# Altium project HVPS.PrjPcb
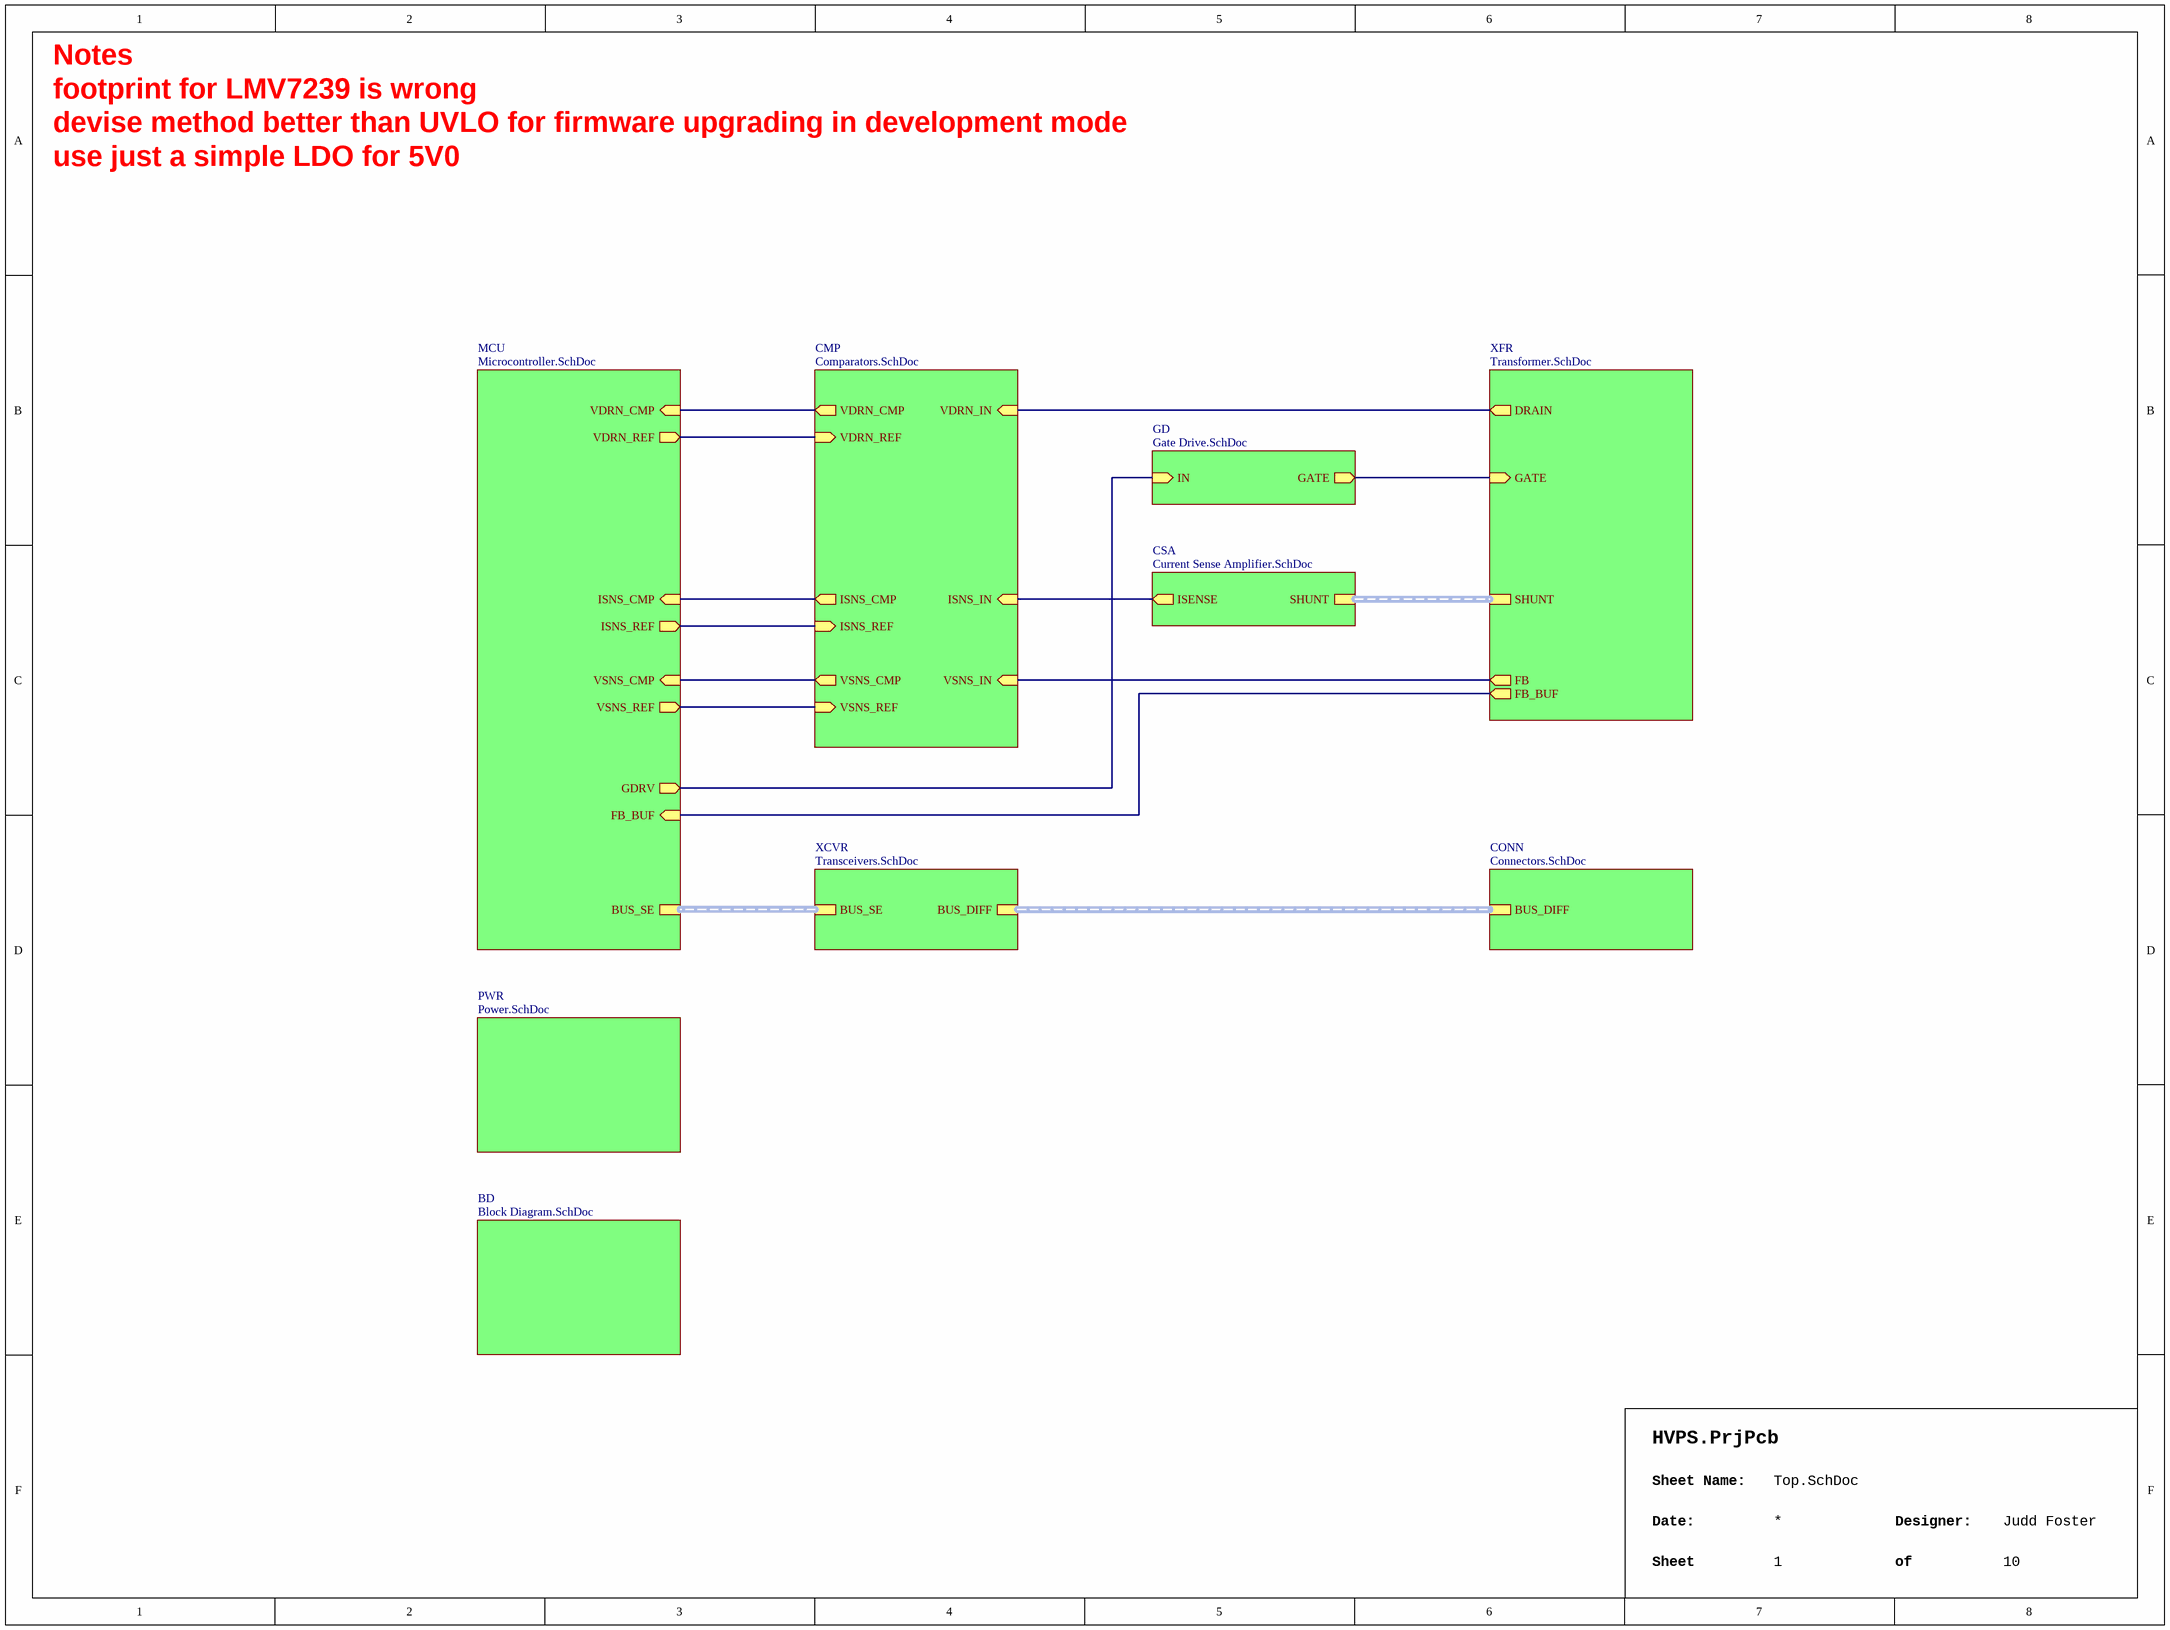
[diagram p0: Top.SchDoc]
Designer: Judd Foster
10 sheets, 140 parts. Net scope: hierarchical (ports join the sheet entries above them; power ports are global).
Board file: HVPS.PcbDoc
Sheets:
  Top.SchDoc
    BD = Block Diagram.SchDoc
    XFR = Transformer.SchDoc
    CSA = Current Sense Amplifier.SchDoc
    PWR = Power.SchDoc
    GD = Gate Drive.SchDoc
    CONN = Connectors.SchDoc
    XCVR = Transceivers.SchDoc
    CMP = Comparators.SchDoc
    MCU = Microcontroller.SchDoc

## Sheet Top.SchDoc
size 406 x 304 mm; SheetNumber: 1; SheetTotal: 10

### Sub-sheets
BD = Block Diagram.SchDoc: no entries
CMP = Comparators.SchDoc: ISNS_CMP (out), VSNS_CMP (out), VDRN_CMP (out), ISNS_REF (in), ISNS_IN (in), VSNS_REF (in), VSNS_IN (in), VDRN_REF (in), VDRN_IN (in)
CONN = Connectors.SchDoc: BUS_DIFF (harness BUS_DIFF)
CSA = Current Sense Amplifier.SchDoc: SHUNT (harness SHUNT), ISENSE (out)
GD = Gate Drive.SchDoc: GATE (out), IN (in)
MCU = Microcontroller.SchDoc: VDRN_CMP (in), VDRN_REF (out), ISNS_CMP (in), ISNS_REF (out), VSNS_CMP (in), VSNS_REF (out), BUS_SE (harness BUS_SE), GDRV (out), FB_BUF (in)
PWR = Power.SchDoc: no entries
XCVR = Transceivers.SchDoc: BUS_SE (harness BUS_SE), BUS_DIFF (harness BUS_DIFF)
XFR = Transformer.SchDoc: DRAIN (out), GATE (in), FB (out), SHUNT (harness SHUNT), FB_BUF (out)

### Nets
DRAIN: sheet XFR/DRAIN, sheet CMP/VDRN_IN
GATE: sheet XFR/GATE, sheet GD/GATE
GDRV: sheet GD/IN, sheet MCU/GDRV
ISENSE: sheet CSA/ISENSE, sheet CMP/ISNS_IN
ISNS_CMP: sheet CMP/ISNS_CMP, sheet MCU/ISNS_CMP
ISNS_REF: sheet CMP/ISNS_REF, sheet MCU/ISNS_REF
VDIV: sheet XFR/FB, sheet CMP/VSNS_IN
VDIV_BUF: sheet XFR/FB_BUF, sheet MCU/FB_BUF
VDRN_CMP: sheet CMP/VDRN_CMP, sheet MCU/VDRN_CMP
VDRN_REF: sheet CMP/VDRN_REF, sheet MCU/VDRN_REF
VSNS_CMP: sheet CMP/VSNS_CMP, sheet MCU/VSNS_CMP
VSNS_REF: sheet CMP/VSNS_REF, sheet MCU/VSNS_REF

### Buses and harness runs
harness sheet CONN/BUS_DIFF = sheet XCVR/BUS_DIFF
harness sheet CSA/SHUNT = sheet XFR/SHUNT
harness sheet MCU/BUS_SE = sheet XCVR/BUS_SE

### Notes on the sheet
- Notes
- footprint for LMV7239 is wrong
- devise method better than UVLO for firmware upgrading in development mode
- use just a simple LDO for 5V0
- Sheet Name:
- Date:
- Sheet
- Designer:
- of

## Sheet Block Diagram.SchDoc
size 406 x 304 mm; SheetNumber: 2; SheetTotal: 10
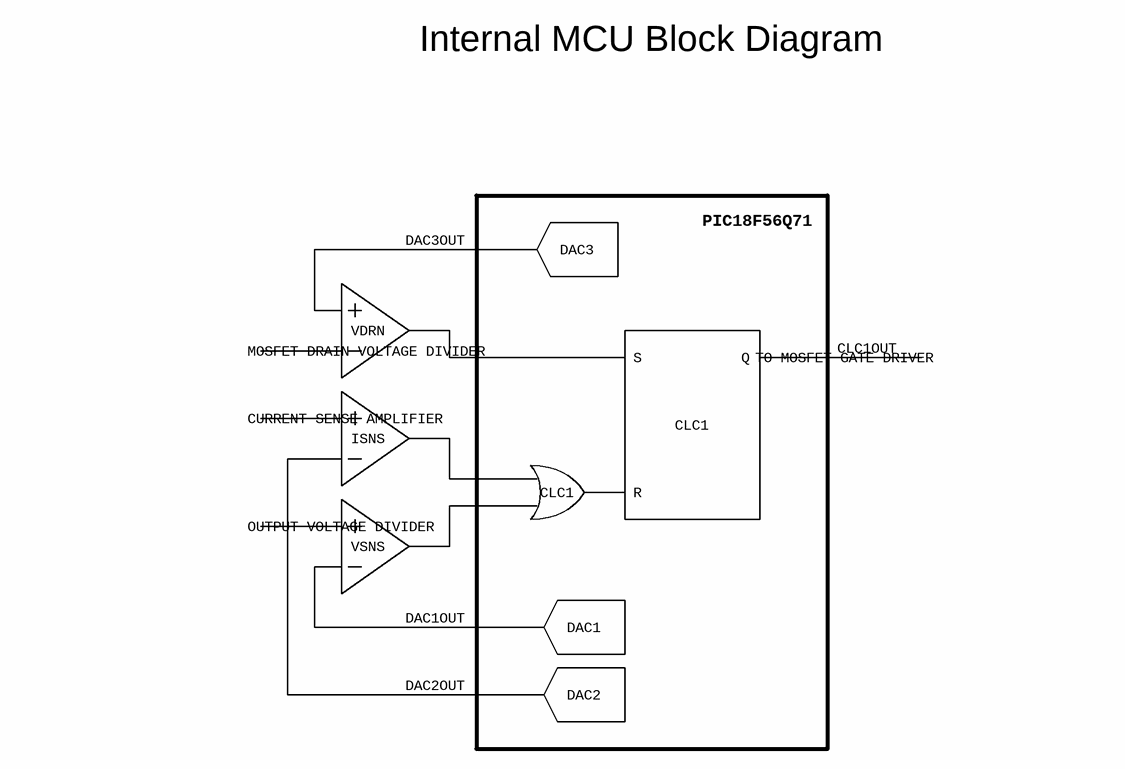
[diagram p1: Block Diagram.SchDoc]

### Notes on the sheet
- Internal MCU Block Diagram
- PIC18F56Q71
- DAC3OUT
- DAC3
- MOSFET DRAIN VOLTAGE DIVIDER
- VDRN
- S
- Q
- CLC1OUT
- TO MOSFET GATE DRIVER
- CURRENT SENSE AMPLIFIER
- CLC1
- ISNS
- R
- OUTPUT VOLTAGE DIVIDER
- VSNS
- DAC1OUT
- DAC1
- DAC2OUT
- DAC2
- Sheet Name:
- Date:
- Sheet
- Designer:
- of

## Sheet Transformer.SchDoc
size 406 x 304 mm; SheetNumber: 3; SheetTotal: 10
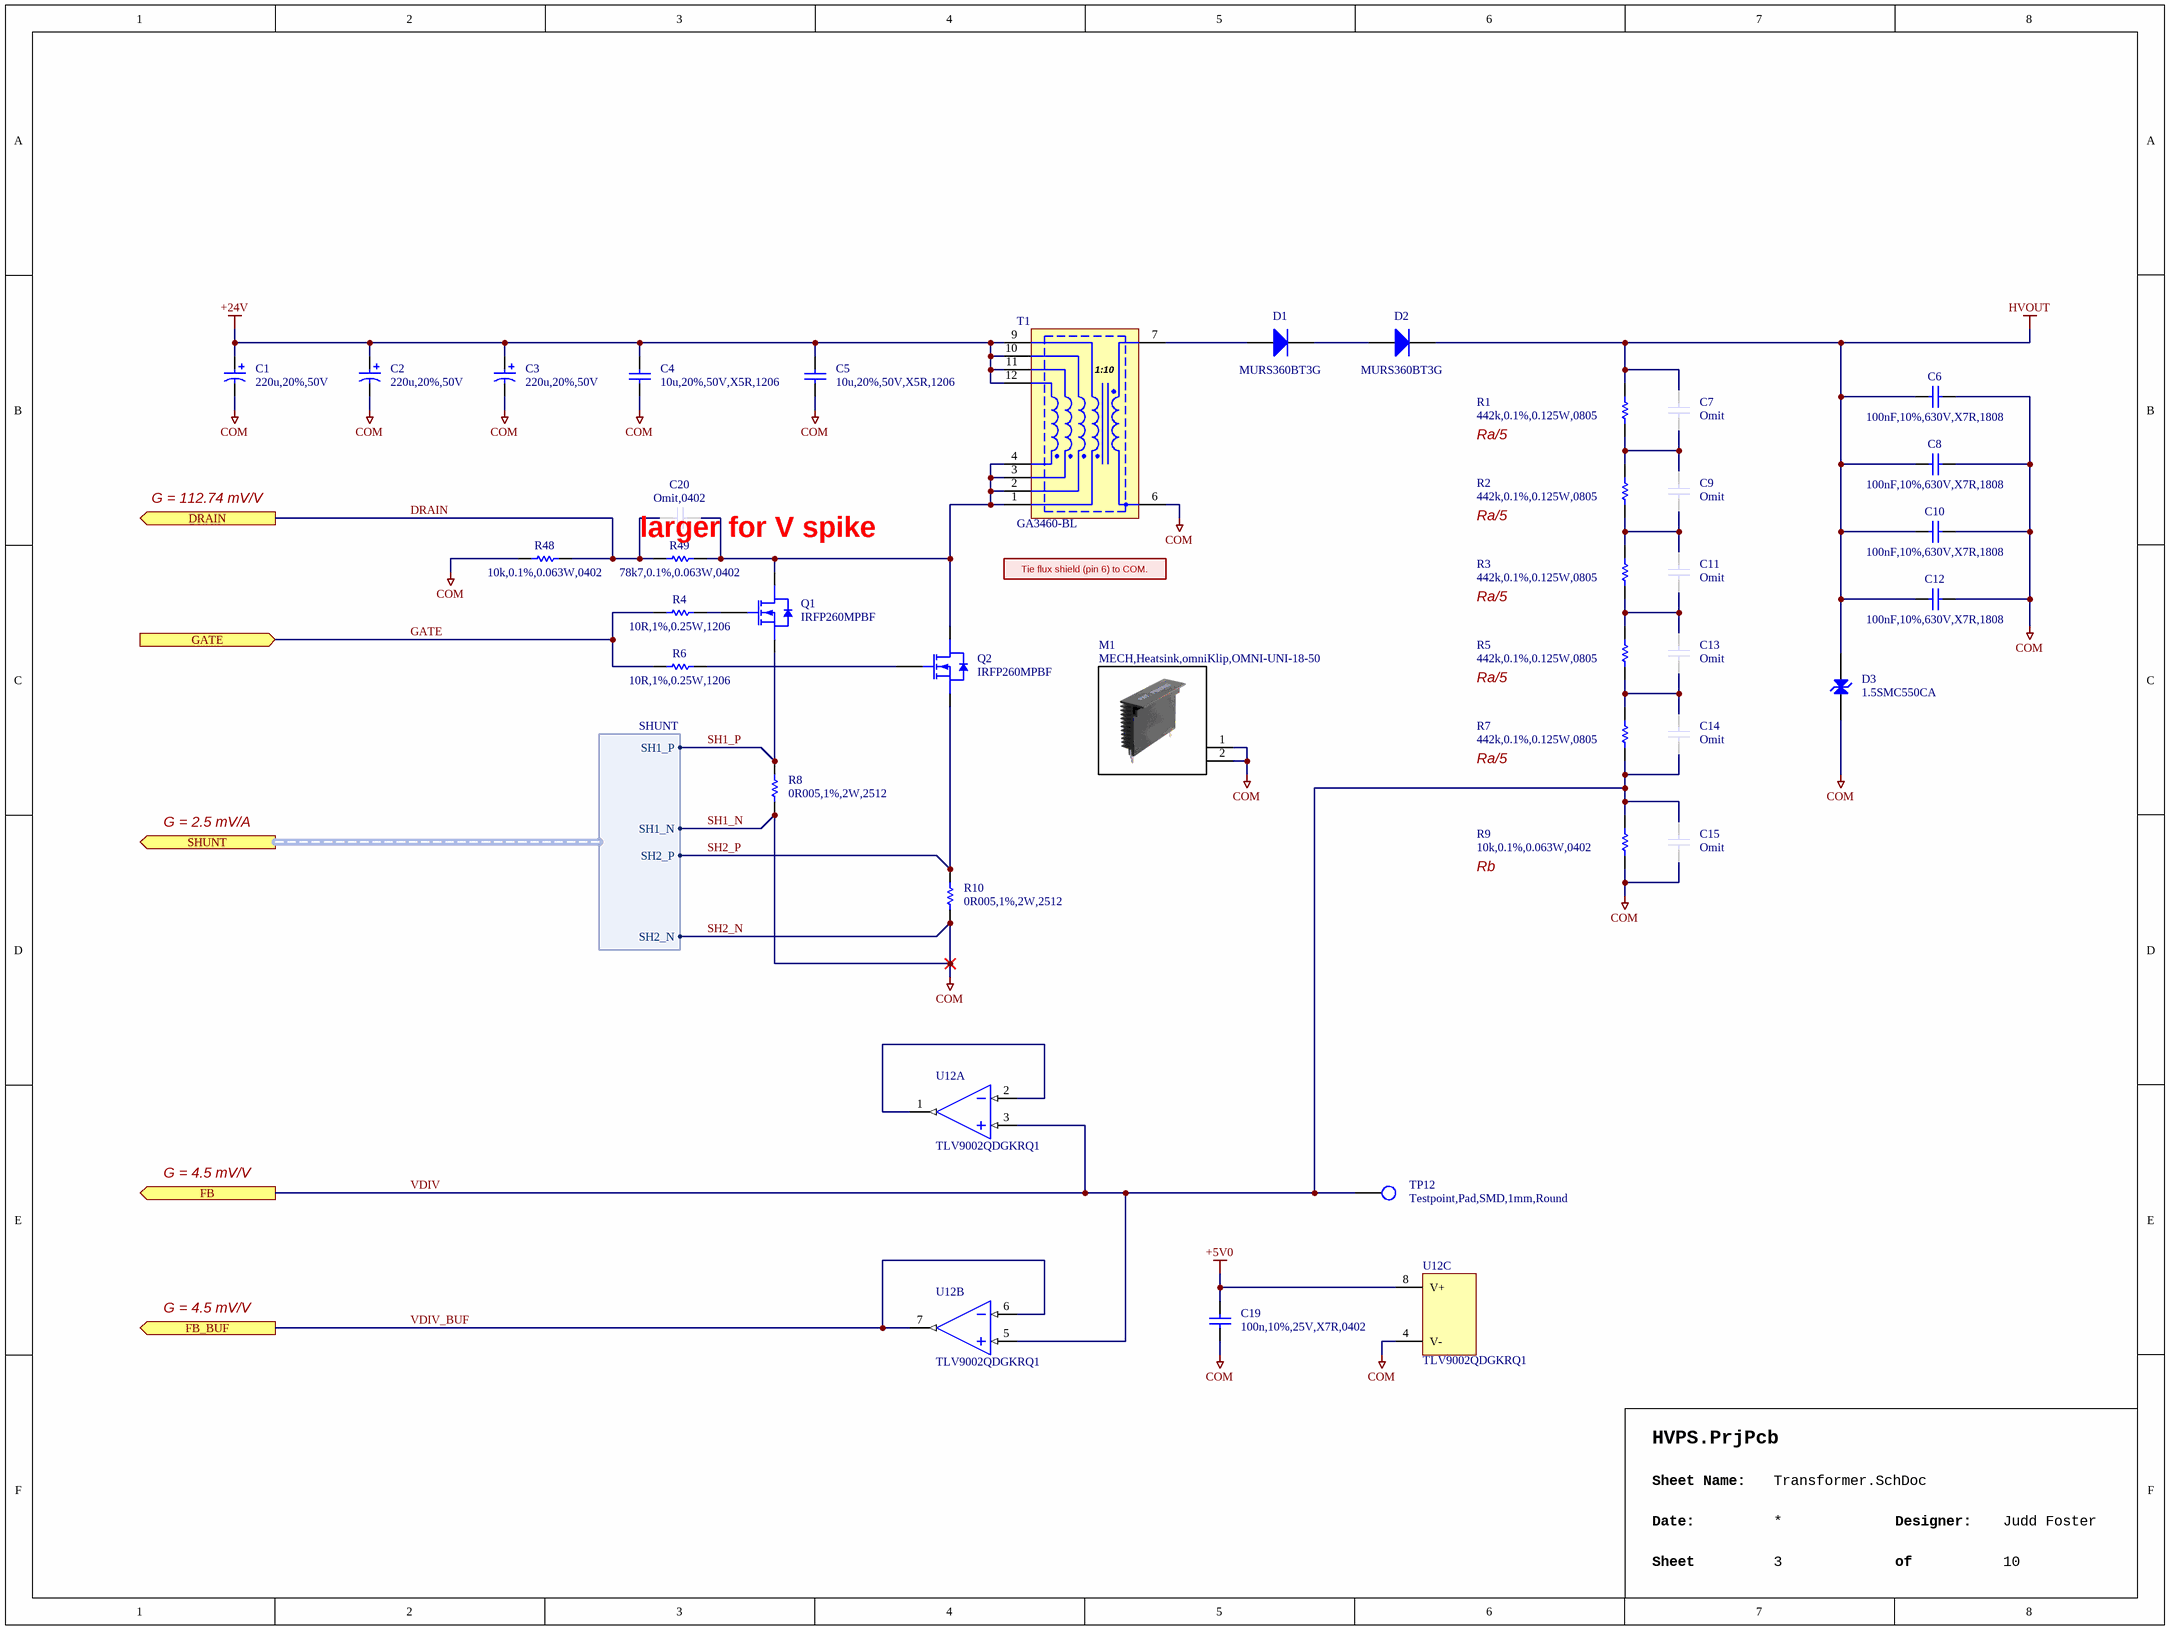
[diagram p2: Transformer.SchDoc]

### Parts
C1  220u,20%,50V  [CAPPR500W60D1000H1600B]
C2  220u,20%,50V  [CAPPR500W60D1000H1600B]
C3  220u,20%,50V  [CAPPR500W60D1000H1600B]
C4  10u,20%,50V,X5R,1206  [CAPC3216X16N]
C5  10u,20%,50V,X5R,1206  [CAPC3216X16N]
C6  100nF,10%,630V,X7R,1808  [KEMET_PKG_LC]
C7  Omit  [CAPC_0805]  (no BOM)
C8  100nF,10%,630V,X7R,1808  [KEMET_PKG_LC]
C9  Omit  [CAPC_0805]  (no BOM)
C10  100nF,10%,630V,X7R,1808  [KEMET_PKG_LC]
C11  Omit  [CAPC_0805]  (no BOM)
C12  100nF,10%,630V,X7R,1808  [KEMET_PKG_LC]
C13  Omit  [CAPC_0805]  (no BOM)
C14  Omit  [CAPC_0805]  (no BOM)
C15  Omit  [CAPC_0805]  (no BOM)
C19  100n,10%,25V,X7R,0402  [CAPC1005X06N]
C20  Omit,0402  [CAPC1005X06N]  (no BOM)
D1  MURS360BT3G  [ONSEMI_SMB]
D2  MURS360BT3G  [ONSEMI_SMB]
D3  1.5SMC550CA  [LITTELFUSE_DO-214AB]
M1  MECH,Heatsink,omniKlip,OMNI-UNI-18-50  [WAKEFIELD_OMNI-UNI-18-50]
Q1  IRFP260MPBF  [INFINEON_PKG_TO247AD]
Q2  IRFP260MPBF  [INFINEON_PKG_TO247AD]
R1  442k,0.1%,0.125W,0805  [RESC2012X07N]
R2  442k,0.1%,0.125W,0805  [RESC2012X07N]
R3  442k,0.1%,0.125W,0805  [RESC2012X07N]
R4  10R,1%,0.25W,1206  [RESC3216X06N]
R5  442k,0.1%,0.125W,0805  [RESC2012X07N]
R6  10R,1%,0.25W,1206  [RESC3216X06N]
R7  442k,0.1%,0.125W,0805  [RESC2012X07N]
R8  0R005,1%,2W,2512  [OHMITE_PKG_MCS3264]
R9  10k,0.1%,0.063W,0402  [RESC1005X04N]
R10  0R005,1%,2W,2512  [OHMITE_PKG_MCS3264]
R48  10k,0.1%,0.063W,0402  [RESC1005X04N]
R49  78k7,0.1%,0.063W,0402  [RESC1005X04N]
T1  GA3460-BL  [COILCRAFT_GA3460-BL]
TP12  Testpoint,Pad,SMD,1mm,Round  [TP100]
U12  TLV9002QDGKRQ1  [SOP65P490X110-8]  (parts A,B,C of 3)

### Ports
DRAIN (out), FB (out), FB_BUF (out), GATE (in), SHUNT (out, harness SHUNT)

### Harnesses
SHUNT: SH1_P, SH1_N, SH2_P, SH2_N

### Nets
+5V0: C19.2 U12.8(V+)
+24V: C1.1 C2.1 C3.1 C4.2 C5.2 T1.9 T1.10 T1.11 T1.12
COM: C1.2 C2.2 C3.2 C4.1 C5.1 C6.1 C8.1 C10.1 C12.1 C15.1 C19.1 D3.2(A) M1.1 M1.2 R8.1 R9.1 R10.1 R48.2 T1.6 U12.4(V-) ; port SHUNT.SH1_N, port SHUNT.SH2_N  [also labelled SH1_N, SH2_N]
HVOUT: C6.2 C7.2 C8.2 C10.2 C12.2 D2.1(K) D3.1(K) R1.2
DRAIN: C20.1 R48.1 R49.1 ; port DRAIN
GATE: R4.1 R6.1 ; port GATE
SH1_P: Q1.3(S) R8.2 ; port SHUNT.SH1_P
SH2_P: Q2.3(S) R10.2 ; port SHUNT.SH2_P
VDIV: C14.1 C15.2 R7.1 R9.2 TP12.1(TP) U12.3(IN1+) U12.5(IN2+) ; port FB
VDIV_BUF: U12.6(IN2-) U12.7(OUT2) ; port FB_BUF
NetC7_1: C7.1 C9.2 R1.1 R2.2
NetC9_1: C9.1 C11.2 R2.1 R3.2
NetC11_1: C11.1 C13.2 R3.1 R5.2
NetC13_1: C13.1 C14.2 R5.1 R7.2
NetC20_2: C20.2 Q1.2(D) Q2.2(D) R49.2 T1.1 T1.2 T1.3 T1.4
NetD1_1: D1.1(K) D2.2(A)
NetD1_2: D1.2(A) T1.7
NetQ1_1: Q1.1(G) R4.2
NetQ2_1: Q2.1(G) R6.2
NetU12_1: U12.1(OUT1) U12.2(IN1-)

### Notes on the sheet
- Ra/5
- G = 112.74 mV/V
- (near C20) larger for V spike
- Tie flux shield (pin 6) to COM.
- G = 2.5 mV/A
- Rb
- G = 4.5 mV/V
- Sheet Name:
- Date:
- Sheet
- Designer:
- of
- (in symbol XFR,Flyback,COILCRAFT_GA3460-BL) 1:10

### Library data of the parts
C1-C3 = CAP,Alum,220uF,20%,50VDC,Radial,Thru: 220 ï¿½F 50 V Aluminum Electrolytic Capacitors Radial, Can 5000 Hrs @ 105ï¿½C; Manufacturer 1: Rubycon; Manufacturer 1 Part Number: 50YXG220MEFCT810X16; Vendor 1 Part Number: 1189-3771-1-ND; Vendor 1: Digikey; Part Name: CAP,Alum,220uF,20%,50VDC,Radial,Thru; CreatedBy: Judd Foster; HelpURL: https://www.rubycon.co.jp/wp-content/uploads/catalog-aluminum/YXG.pdf; Value: 220u
C4 C5 = CAP,Cer,10uF,50VDC,X5R,1206: 10ï¿½F ï¿½20% 50V Ceramic Capacitor X5R 1206 (3216 Metric); Manufacturer 1: Samsung Electro-Mechanics; Manufacturer 1 Part Number: CL31A106MBHNNNE; Vendor 1 Part Number: 1276-6736-1-ND; Vendor 1: Digikey; Part Name: CAP,Cer,10uF,50VDC,X5R,1206; CreatedBy: Judd Foster; HelpURL: https://www.samsungsem.com/resources/file/global/support/product_catalog/MLCC.pdf; Value: 10u
C6 C8 C10 C12 = CAP,Cer,100nF,10%,630V,X7R,1808: 0.1 ÂµF Â±10% 630V Ceramic Capacitor X7R 1808 (4520 Metric); Manufacturer 1: KEMET; Manufacturer 1 Part Number: C1808C104KBRAC7800; Vendor 1 Part Number: 399-C1808C104KBRAC7800CT-ND; Vendor 1: DigiKey; Part Name: CAP,Cer,100nF,10%,630V,X7R,1808; CreatedBy: Judd Foster; HelpURL: https://content.kemet.com/datasheets/KEM_C1010_X7R_HV_SMD.pdf; Value: 100nF
C7 C9 C11 C13-C15 = CAP,Omit,0805: Part Name: CAP,Omit,0805; CreatedBy: Judd Foster; HelpURL: N/A; Manufacturer 1: N/A; Manufacturer 1 Part Number: N/A; Vendor 1: N/A; Vendor 1 Part Number: N/A; Value: Omit
C19 = CAP,Cer,100nF,10%,25V,X7R,0402: 0.1ï¿½F ï¿½10% 25V Ceramic Capacitor X7R 0402 (1005 Metric); Manufacturer 1: Murata Electronics; Manufacturer 1 Part Number: GRM155R71E104KE14J; Vendor 1 Part Number: 490-14603-1-ND; Vendor 1: DigiKey; Value: 100nF; Part Name: CAP,Cer,100nF,10%,25V,X7R,0402; CreatedBy: Judd Foster; HelpURL: https://search.murata.co.jp/Ceramy/image/img/A01X/G101/ENG/GRM155R71E104KE14-01.pdf
C20 = CAP,Omit,0402: Omit; Part Name: CAP,Omit,0402; CreatedBy: Judd Foster; HelpURL: N/A; Manufacturer 1: N/A; Manufacturer 1 Part Number: N/A; Vendor 1: N/A; Vendor 1 Part Number: N/A; Value: Omit
D1 D2 = Diode,Gen,600V,3A,SMB: Diode 600 V 3A Surface Mount SMB; Manufacturer 1: onsemi; Vendor 1 Part Number: MURS360BT3GOSCT-ND; Vendor 1: Digikey; Part Name: Diode,Gen,600V,3A,SMB; CreatedBy: Judd Foster; HelpURL: https://www.onsemi.com/pdf/datasheet/murs360bt3-d.pdf; Manufacturer 1 Part Number: MURS360BT3G
D3 = DIODE,TVS,495VWM,SMD: 760V Clamp 2A Ipp Tvs Diode Surface Mount DO-214AB (SMCJ); Manufacturer 1: Littelfuse Inc.; Vendor 1 Part Number: 1.5SMC550CACT-ND; Vendor 1: Digikey; Part Name: DIODE,TVS,495VWM,SMD; CreatedBy: Judd Foster; HelpURL: https://www.littelfuse.com/~/media/electronics/datasheets/tvs_diodes/littelfuse_tvs_diode_1_5smc_datasheet.pdf.pdf; Manufacturer 1 Part Number: 1.5SMC550CA
M1 = MECH,Heatsink,omniKlip,OMNI-UNI-18-50: Heat Sinks omniKlip Heat Sink for TO-247, TO-264, 18mm Wide, 50mm Long, Aluminum; Manufacturer 1: Wakefield Thermal; Vendor 1 Part Number: 567-OMNI-UNI-18-50; Vendor 1: Mouser; Part Name: MECH,Heatsink,omniKlip,OMNI-UNI-18-50; CreatedBy: Judd Foster; HelpURL: https://www.mouser.com/datasheet/2/433/omniKlip_Wakefield_Vette-3050203.pdf; Manufacturer 1 Part Number: OMNI-UNI-18-50
Q1 Q2 = MOSFET,N Ch,200V,50A,IRFP260MPBF: N-Channel 200 V 50A (Tc) 300W (Tc) Through Hole TO-247AC; Manufacturer 1: Infineon Technologies; Vendor 1 Part Number: IRFP260MPBF-ND; Vendor 1: DigiKey; Part Name: MOSFET,N Ch,200V,50A,IRFP260MPBF; CreatedBy: Judd Foster; HelpURL: https://www.infineon.com/dgdl/irfp260mpbf.pdf?fileId=5546d462533600a40153562894e91fe0; Manufacturer 1 Part Number: IRFP260MPBF
R1-R3 R5 R7 = RES,442k,0.1%,0.125W,0805: 442 kOhms Â±0.1% 0.125W, 1/8W Chip Resistor 0805 (2012 Metric) Automotive AEC-Q200 Thin Film; Manufacturer 1: Panasonic Electronic Components; Manufacturer 1 Part Number: ERA-6AEB4423V; Vendor 1 Part Number: P442KDACT-ND; Vendor 1: DigiKey; Part Name: RES,442k,0.1%,0.125W,0805; CreatedBy: Judd Foster; HelpURL: https://industrial.panasonic.com/cdbs/www-data/pdf/RDM0000/AOA0000C307.pdf; Value: 442k
R4 R6 = RES,10R,1%,0.25W,1206: 10 ï¿½1% 0.25W, 1/4W Chip Resistor 1206 (3216 Metric) Automotive AEC-Q200, Moisture Resistant Thick Film; Manufacturer 1: TE Connectivity Passive Product; Manufacturer 1 Part Number: CRGCQ1206F10R; Vendor 1 Part Number: A129786CT-ND; Vendor 1: Digikey; Part Name: RES,10R,1%,0.25W,1206; CreatedBy: Judd Foster; HelpURL: https://www.te.com/commerce/DocumentDelivery/DDEController?Action=srchrtrv&DocNm=1773204-3&DocType=DS&DocLang=English; Value: 10R
R8 R10 = RES,0R005,1%,2W,2512: 5 mOhms Â±1% 2W Chip Resistor 2512 (6432 Metric) Current Sense, Flame Retardant Coating, Safety Metal Element; Manufacturer 1: Ohmite; Manufacturer 1 Part Number: MCS3264R005FER; Vendor 1 Part Number: MCS3264R005FERCT-ND; Vendor 1: DigiKey; Value: 5m; Part Name: RES,0R005,1%,2W,2512; CreatedBy: Judd Foster; HelpURL: https://www.ohmite.com/assets/images/res-mcs.pdf
R9 R48 = RES,10k,0.1%,0.063W,0402: 10 kOhms ï¿½0.1% 0.1W, 1/10W Chip Resistor 0402 (1005 Metric) Automotive AEC-Q200 Thin Film; Manufacturer 1: Stackpole Electronics Inc; Manufacturer 1 Part Number: RNCF0402BTE10K0; Vendor 1 Part Number: RNCF0402BTE10K0CT-ND; Vendor 1: Digikey; Part Name: RES,10k,0.1%,0.063W,0402; CreatedBy: Judd Foster; HelpURL: https://www.seielect.com/catalog/sei-rncf.pdf; Value: 10k
R49 = RES,78k7,0.1%,0.063W,0402: 78.7 kOhms ï¿½0.1% 0.063W, 1/16W Chip Resistor 0402 (1005 Metric) Thin Film; Manufacturer 1: Yageo; Manufacturer 1 Part Number: RT0402BRD0778K7L; Vendor 1 Part Number: YAG4311CT-ND; Vendor 1: Digikey; Part Name: RES,78k7,0.1%,0.063W,0402; CreatedBy: Judd Foster; HelpURL: https://www.yageo.com/upload/media/product/productsearch/datasheet/rchip/PYu-RT_1-to-0.01_RoHS_L_13.pdf; Value: 78k7
T1 = XFR,Flyback,COILCRAFT_GA3460-BL: Audio Transformers / Signal Transformers GA3460 for LT3751 500V 50A; Vendor 1 Part Number: 994-GA3460-BL; Vendor 1: Mouser; Part Name: XFR,Flyback,COILCRAFT_GA3460-BL; CreatedBy: Judd Foster; HelpURL: https://www.mouser.ca/datasheet/2/597/ga3459-463457.pdf; Manufacturer 1: Coilcraft; Manufacturer 1 Part Number: GA3460-BL
TP12 = Testpoint,Pad,SMD: PCB Testpoint 1mm Round; Part Name: Testpoint,Pad,SMD; CreatedBy: Judd Foster; HelpURL: N/A; Manufacturer 1: N/A; Manufacturer 1 Part Number: N/A; Vendor 1: N/A; Vendor 1 Part Number: N/A
U12 = TLV9002QDGKRQ1: General Purpose Amplifier Circuit Rail-to-Rail 8-VSSOP; Manufacturer 1: Texas Instruments; Vendor 1 Part Number: 296-TLV9002QDGKRQ1CT-ND; Vendor 1: Digikey; Part Name: TLV9002QDGKRQ1; CreatedBy: Judd Foster; HelpURL: https://www.ti.com/lit/ds/symlink/tlv9001-q1.pdf?ts=1702270446565&ref_url=https%253A%252F%252Fwww.google.com%252F; Manufacturer 1 Part Number: TLV9002QDGKRQ1

## Sheet Current Sense Amplifier.SchDoc
size 406 x 304 mm; SheetNumber: 4; SheetTotal: 10
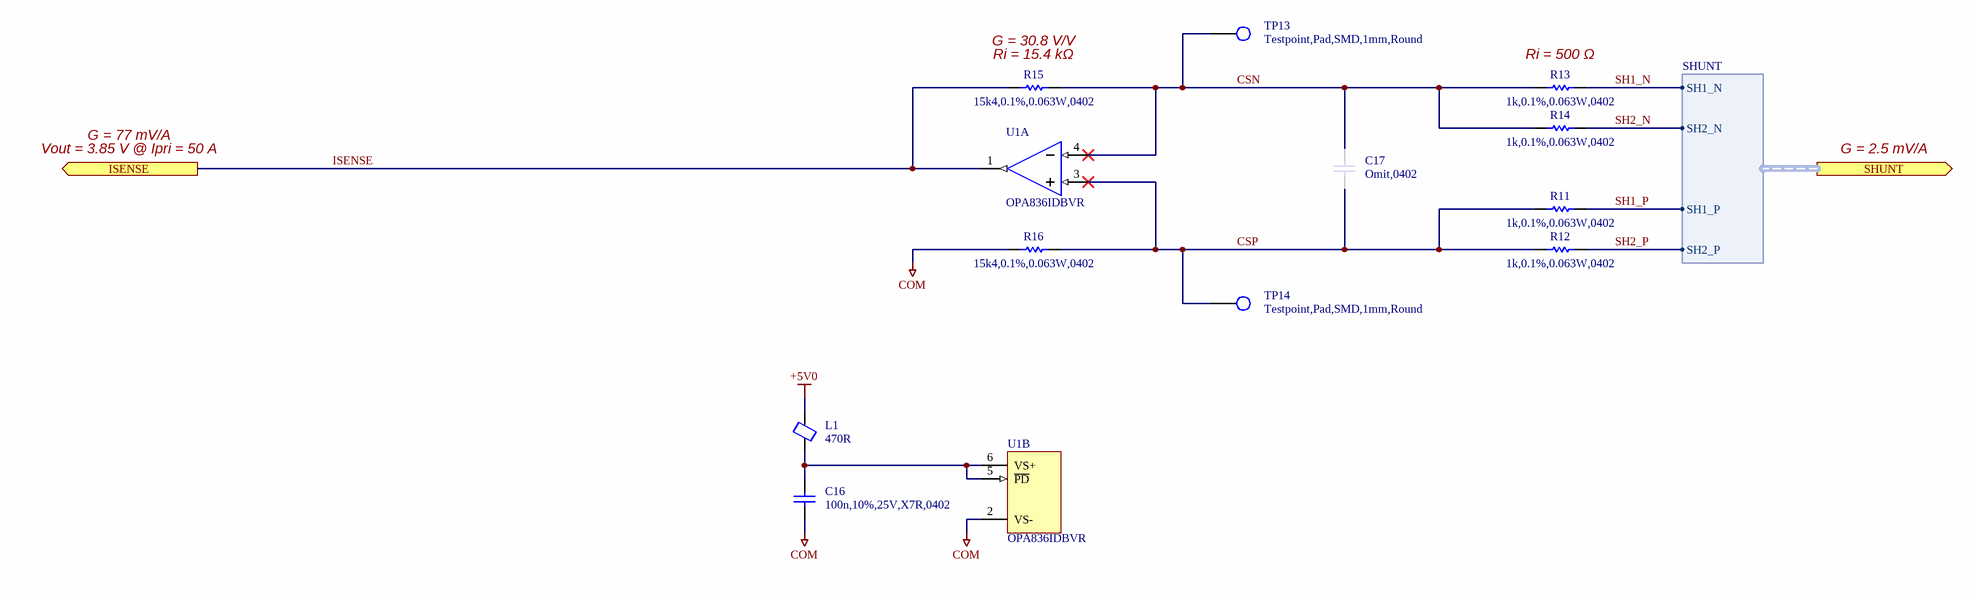
[diagram p3: Current Sense Amplifier.SchDoc]

### Parts
C16  100n,10%,25V,X7R,0402  [CAPC1005X06N]
C17  Omit,0402  [CAPC1005X06N]  (no BOM)
L1  470R  [INDC1005X05N]
R11  1k,0.1%,0.063W,0402  [RESC1005X04N]
R12  1k,0.1%,0.063W,0402  [RESC1005X04N]
R13  1k,0.1%,0.063W,0402  [RESC1005X04N]
R14  1k,0.1%,0.063W,0402  [RESC1005X04N]
R15  15k4,0.1%,0.063W,0402  [RESC1005X04N]
R16  15k4,0.1%,0.063W,0402  [RESC1005X04N]
TP13  Testpoint,Pad,SMD,1mm,Round  [TP100]
TP14  Testpoint,Pad,SMD,1mm,Round  [TP100]
U1  OPA836IDBVR  [TEXASINSTRUMENTS_PKG_DBV0006A]  (parts A,B of 2)

### Ports
ISENSE (out), SHUNT (out, harness SHUNT)

### Harnesses
SHUNT: SH1_P, SH1_N, SH2_P, SH2_N

### Nets
+5V0: L1.2
COM: C16.1 R13.2 R14.2 R16.1 U1.2(VS-) ; port SHUNT.SH1_N, port SHUNT.SH2_N  [also labelled SH1_N, SH2_N]
CSN: C17.1 R13.1 R14.1 R15.2 TP13.1(TP) U1.4(VIN-)
CSP: C17.2 R11.1 R12.1 R16.2 TP14.1(TP) U1.3(VIN+)
ISENSE: R15.1 U1.1(VOUT) ; port ISENSE
SH1_P: R11.2 ; port SHUNT.SH1_P
SH2_P: R12.2 ; port SHUNT.SH2_P
NetC16_2: C16.2 L1.1 U1.5(~{PD}) U1.6(VS+)

### Notes on the sheet
- (near R15) G = 30.8 V/V
- (near R15) Ri = 15.4 kΩ
- (near R13) Ri = 500 Ω
- G = 77 mV/A
- Vout = 3.85 V @ Ipri = 50 A
- G = 2.5 mV/A
- Sheet Name:
- Date:
- Sheet
- Designer:
- of

### Library data of the parts
C16 = CAP,Cer,100nF,10%,25V,X7R,0402: as C19 on sheet Transformer; Part Name: CAP,Cer,100nF,10%,25V,X7R,0402; CreatedBy: Judd Foster; HelpURL: https://search.murata.co.jp/Ceramy/image/img/A01X/G101/ENG/GRM155R71E104KE14-01.pdf
C17 = CAP,Omit,0402: Omit; Part Name: CAP,Omit,0402; CreatedBy: Judd Foster; HelpURL: N/A; Manufacturer 1: N/A; Manufacturer 1 Part Number: N/A; Vendor 1: N/A; Vendor 1 Part Number: N/A; Value: Omit
L1 = Ferrite,470R@100MHz,0402: 470 Ohms @ 100 MHz 1 Power Line Ferrite Bead 0402 (1005 Metric) 1A 200mOhm; Manufacturer 1: Murata Electronics; Manufacturer 1 Part Number: BLM15PX471SN1D; Vendor 1 Part Number: 490-10662-1-ND; Vendor 1: Digikey; Part Name: Ferrite,470R@100MHz,0402; CreatedBy: Judd Foster; HelpURL: https://www.murata.com/en-us/products/productdata/8796740059166/ENFA0018.pdf; Value: 470R
R11-R14 = RES,1k,0.1%,0.063W,0402: 1 kOhms Â±0.1% 0.063W, 1/16W Chip Resistor 0402 (1005 Metric) Thin Film; Manufacturer 1: YAGEO; Manufacturer 1 Part Number: RT0402BRE071KL; Vendor 1 Part Number: YAG2306CT-ND; Vendor 1: DigiKey; Part Name: RES,1k,0.1%,0.063W,0402; CreatedBy: Judd Foster; HelpURL: https://www.yageo.com/upload/media/product/app/datasheet/rchip/pyu-rt_1-to-0.01_rohs_l.pdf; Value: 1k
R15 R16 = RES,15k4,0.1%,0.063W,0402: 15.4 kOhms Â±0.1% 0.063W, 1/16W Chip Resistor 0402 (1005 Metric) Thin Film; Manufacturer 1: YAGEO; Manufacturer 1 Part Number: RT0402BRD0715K4L; Vendor 1 Part Number: YAG4177CT-ND; Vendor 1: DigiKey; Part Name: RES,15k4,0.1%,0.063W,0402; CreatedBy: Judd Foster; HelpURL: https://www.yageo.com/upload/media/product/app/datasheet/rchip/pyu-rt_1-to-0.01_rohs_l.pdf; Value: 15k4
TP13 TP14 = Testpoint,Pad,SMD: PCB Testpoint 1mm Round; Part Name: Testpoint,Pad,SMD; CreatedBy: Judd Foster; HelpURL: N/A; Manufacturer 1: N/A; Manufacturer 1 Part Number: N/A; Vendor 1: N/A; Vendor 1 Part Number: N/A
U1 = OPA836IDBVR: Voltage Feedback Amplifier 1 Circuit Rail-to-Rail SOT-23-6; Manufacturer 1: Texas Instruments; Vendor 1 Part Number: 296-44388-1-ND; Vendor 1: DigiKey; Part Name: OPA836IDBVR; CreatedBy: Judd Foster; HelpURL: https://www.ti.com/lit/ds/symlink/opa836.pdf?HQS=dis-dk-null-digikeymode-dsf-pf-null-wwe&ts=1741112370606&ref_url=https%253A%252F%252Fwww.ti.com%252Fgeneral%252Fdocs%252Fsuppproductinfo.tsp%253FdistId%253D10%2526gotoUrl%253Dhttps%253A%252F%252Fwww.ti.com%; Manufacturer 1 Part Number: OPA836IDBVR

## Sheet Power.SchDoc
size 406 x 304 mm; SheetNumber: 5; SheetTotal: 10
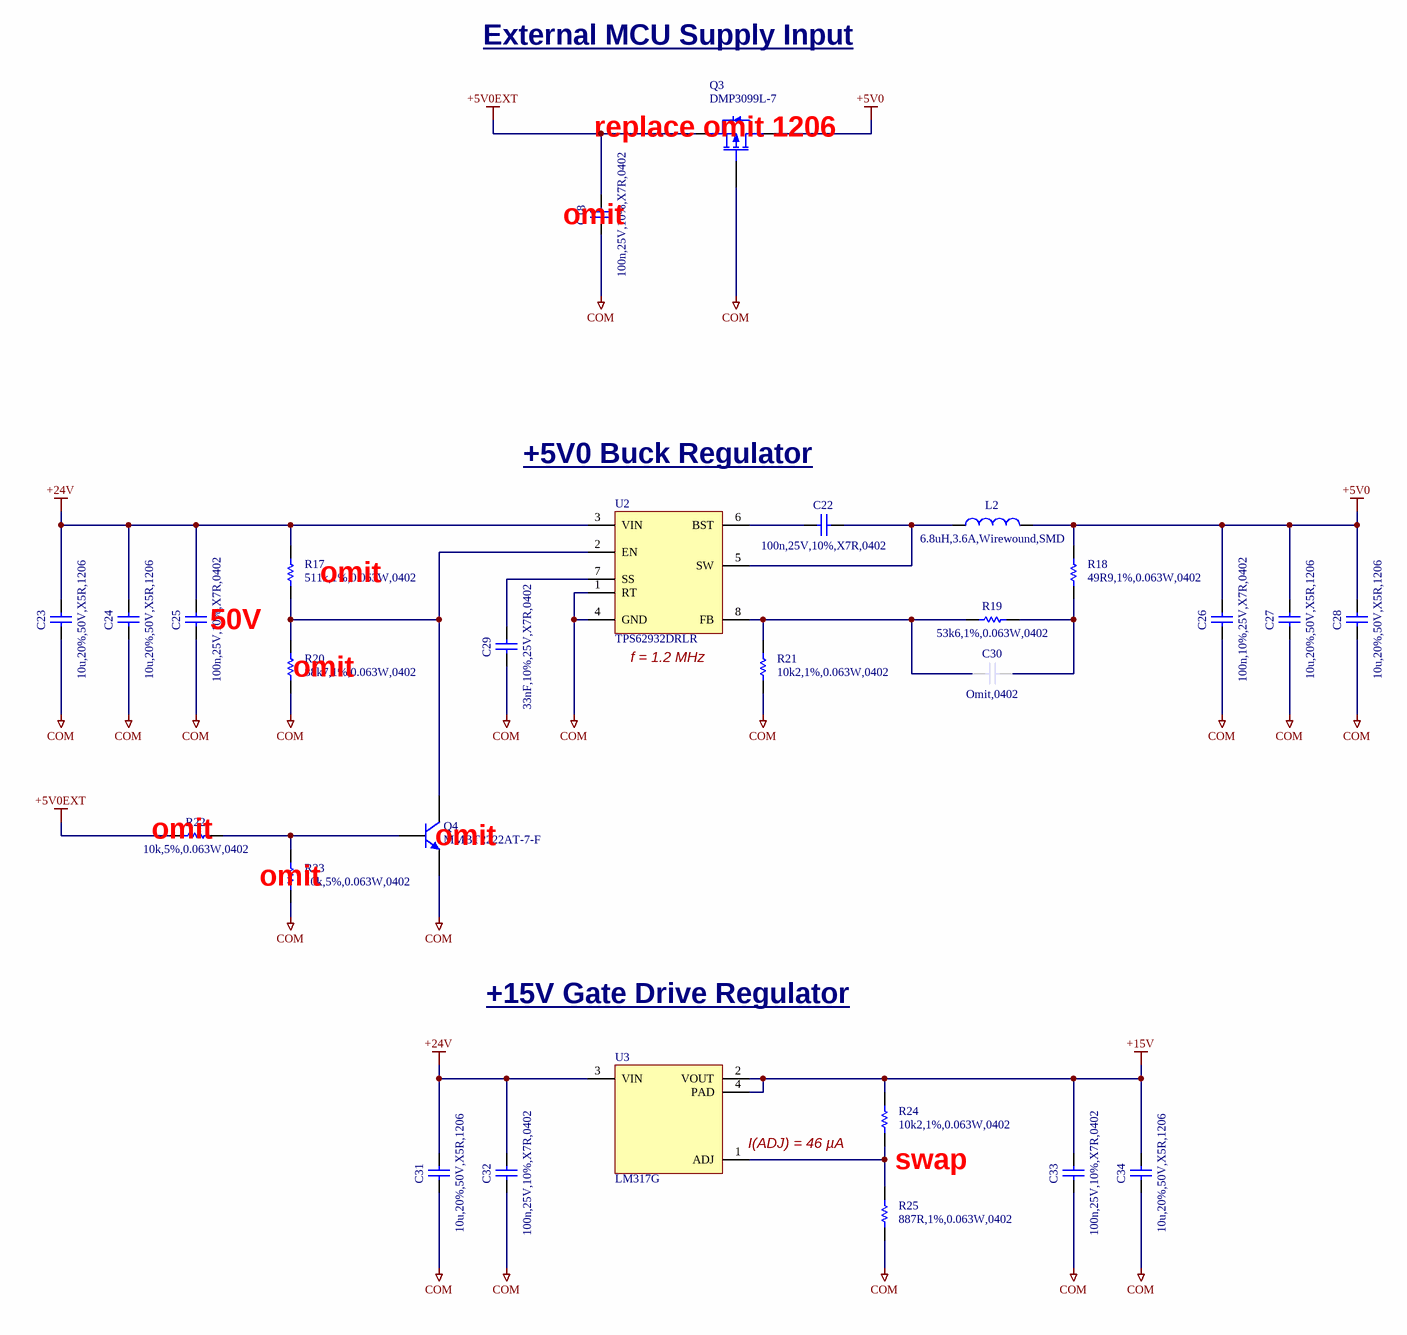
[diagram p4: Power.SchDoc]

### Parts
C18  100n,25V,10%,X7R,0402  [CAPC1005X06N]
C22  100n,25V,10%,X7R,0402  [CAPC1005X06N]
C23  10u,20%,50V,X5R,1206  [CAPC3216X16N]
C24  10u,20%,50V,X5R,1206  [CAPC3216X16N]
C25  100n,25V,10%,X7R,0402  [CAPC1005X06N]
C26  100n,10%,25V,X7R,0402  [CAPC1005X06N]
C27  10u,20%,50V,X5R,1206  [CAPC3216X16N]
C28  10u,20%,50V,X5R,1206  [CAPC3216X16N]
C29  33nF,10%,25V,X7R,0402  [CAPC1005X06N]
C30  Omit,0402  [CAPC1005X06N]  (no BOM)
C31  10u,20%,50V,X5R,1206  [CAPC3216X16N]
C32  100n,25V,10%,X7R,0402  [CAPC1005X06N]
C33  100n,25V,10%,X7R,0402  [CAPC1005X06N]
C34  10u,20%,50V,X5R,1206  [CAPC3216X16N]
L2  6.8uH,3.6A,Wirewound,SMD  [BOURNS_SRN6045TA]
Q3  DMP3099L-7  [DIODES_SOT23]
Q4  MMBT2222AT-7-F  [SOTFL50P160X90-3N]
R17  511k,1%,0.063W,0402  [RESC1005X04N]
R18  49R9,1%,0.063W,0402  [RESC1005X04N]
R19  53k6,1%,0.063W,0402  [RESC1005X04N]
R20  88k7,1%,0.063W,0402  [RESC1005X04N]
R21  10k2,1%,0.063W,0402  [RESC1005X04N]
R22  10k,5%,0.063W,0402  [RESC1005X04N]
R23  10k,5%,0.063W,0402  [RESC1005X04N]
R24  10k2,1%,0.063W,0402  [RESC1005X04N]
R25  887R,1%,0.063W,0402  [RESC1005X04N]
U2  TPS62932DRLR  [TEXASINSTRUMENTS_PKG_DRL0008A]
U3  LM317G  [UMW_PKG_SOT223-3L]

### Nets
+5V0: C26.2 C27.2 C28.2 L2.2 Q3.3(D) R18.2
+5V0EXT: C18.2 Q3.2(S) R22.2
+15V: C33.2 C34.2 R24.2 U3.2(VOUT) U3.4(PAD)
+24V: C23.2 C24.2 C25.2 C31.2 C32.2 R17.2 U2.3(VIN) U3.3(VIN)
COM: C18.1 C23.1 C24.1 C25.1 C26.1 C27.1 C28.1 C29.1 C31.1 C32.1 C33.1 C34.1 Q3.1(G) Q4.2(E) R20.1 R21.1 R23.2 R25.1 U2.1(RT) U2.4(GND)
NetC22_1: C22.1 L2.1 U2.5(SW)
NetC22_2: C22.2 U2.6(BST)
NetC29_2: C29.2 U2.7(SS)
NetC30_1: C30.1 R19.2 R21.2 U2.8(FB)
NetC30_2: C30.2 R18.1 R19.1
NetQ4_1: Q4.1(B) R22.1 R23.1
NetQ4_3: Q4.3(C) R17.1 R20.2 U2.2(EN)
NetR24_1: R24.1 R25.2 U3.1(ADJ)

### Notes on the sheet
- External MCU Supply Input
- (near Q3) replace omit 1206
- (near C18) omit
- +5V0 Buck Regulator
- (near C25) 50V
- (near R17) omit
- (near R20) omit
- (near U2) f = 1.2 MHz
- (near R22) omit
- (near R23) omit
- (near Q4) omit
- +15V Gate Drive Regulator
- I(ADJ) = 46 µA
- swap
- Sheet Name:
- Date:
- Sheet
- Designer:
- of

### Library data of the parts
C18 C22 C25 C32 C33 = CAP,Cer,100nF,10%,25VDC,X7R,0402: 0.1ï¿½F ï¿½10% 25V Ceramic Capacitor X7R 0402 (1005 Metric); Manufacturer 1: Murata Electronics; Manufacturer 1 Part Number: GRM155R71E104KE14J; Vendor 1 Part Number: 490-14603-1-ND; Vendor 1: DigiKey; Value: 100nF; Part Name: CAP,Cer,100nF,10%,25VDC,X7R,0402; CreatedBy: Judd Foster; HelpURL: https://search.murata.co.jp/Ceramy/image/img/A01X/G101/ENG/GRM155R71E104KE14-01.pdf
C23 C24 C27 C28 C31 C34 = CAP,Cer,10uF,50VDC,X5R,1206: as C4 on sheet Transformer; Part Name: CAP,Cer,10uF,50VDC,X5R,1206; CreatedBy: Judd Foster; HelpURL: https://www.samsungsem.com/resources/file/global/support/product_catalog/MLCC.pdf; Value: 10u
C26 = CAP,Cer,100nF,10%,25V,X7R,0402: as C19 on sheet Transformer; Part Name: CAP,Cer,100nF,10%,25V,X7R,0402; CreatedBy: Judd Foster; HelpURL: https://search.murata.co.jp/Ceramy/image/img/A01X/G101/ENG/GRM155R71E104KE14-01.pdf
C29 = CAP,Cer,33nF,10%,25V,X7R,0402: 0.033 ÂµF Â±10% 25V Ceramic Capacitor X7R 0402 (1005 Metric); Manufacturer 1: Murata Electronics; Manufacturer 1 Part Number: GRM155R71E333KA88D; Vendor 1 Part Number: 490-3253-1-ND; Vendor 1: DigiKey; Part Name: CAP,Cer,33nF,10%,25V,X7R,0402; CreatedBy: Judd Foster; HelpURL: https://search.murata.co.jp/Ceramy/image/img/A01X/G101/ENG/GRM155R71E333KA88-01.pdf; Value: 33nF
C30 = CAP,Omit,0402: Omit; Part Name: CAP,Omit,0402; CreatedBy: Judd Foster; HelpURL: N/A; Manufacturer 1: N/A; Manufacturer 1 Part Number: N/A; Vendor 1: N/A; Vendor 1 Part Number: N/A; Value: Omit
L2 = IND,6.8uH,3.6A,Wirewound,SMD: 6.8 ÂµH Semi-Shielded Drum Core, Wirewound Inductor 3.6 A 34mOhm Nonstandard; Manufacturer 1: Bourns Inc.; Manufacturer 1 Part Number: SRN6045TA-6R8M; Vendor 1 Part Number: SRN6045TA-6R8MCT-ND; Vendor 1: DigiKey; Part Name: IND,6.8uH,3.6A,Wirewound,SMD; CreatedBy: Judd Foster; HelpURL: https://www.bourns.com/docs/Product-Datasheets/SRN6045TA.pdf; Value: 6.8uH
Q3 = MOSFET,P Ch,30V,3.8A: P-Channel 30 V 3.8A (Ta) 1.08W (Ta) Surface Mount SOT-23-3; Manufacturer 1: Diodes Incorporated; Vendor 1 Part Number: DMP3099L-7DICT-ND; Vendor 1: Digikey; Part Name: MOSFET,P Ch,30V,3.8A; CreatedBy: Judd Foster; HelpURL: https://www.diodes.com/assets/Datasheets/DMP3099L.pdf; Manufacturer 1 Part Number: DMP3099L-7
Q4 = Trans,NPN,40V,600mA,SOT523: Bipolar (BJT) Transistor NPN 40 V 600 mA 300MHz 150 mW Surface Mount SOT-523; Manufacturer 1: Diodes Incorporated; Vendor 1 Part Number: MMBT2222AT-FDICT-ND; Vendor 1: Digikey; Part Name: Trans,NPN,40V,600mA,SOT523; CreatedBy: Judd Foster; HelpURL: https://media.digikey.com/pdf/Data%20Sheets/Diodes%20PDFs/MMBT2222AT_Rev2016.pdf; Manufacturer 1 Part Number: MMBT2222AT-7-F
R17 = RES,511k,1%,0.063W,0402: 511 kOhms Â±1% 0.063W, 1/16W Chip Resistor 0402 (1005 Metric) Moisture Resistant Thick Film; Manufacturer 1: YAGEO; Manufacturer 1 Part Number: RC0402FR-07511KL; Vendor 1 Part Number: YAG3176CT-ND; Vendor 1: DigiKey; Part Name: RES,511k,1%,0.063W,0402; CreatedBy: Judd Foster; HelpURL: https://www.yageo.com/upload/media/product/products/datasheet/rchip/PYu-RC_Group_51_RoHS_L_12.pdf; Value: 511k
R18 = RES,49R9,1%,0.063W,0402: 49.9 Ohms Â±1% 0.063W, 1/16W Chip Resistor 0402 (1005 Metric) Moisture Resistant Thick Film; Manufacturer 1: YAGEO; Manufacturer 1 Part Number: RC0402FR-0749R9L; Vendor 1 Part Number: 311-49.9LRCT-ND; Vendor 1: DigiKey; Part Name: RES,49R9,1%,0.063W,0402; CreatedBy: Judd Foster; HelpURL: https://www.yageo.com/upload/media/product/products/datasheet/rchip/PYu-RC_Group_51_RoHS_L_12.pdf; Value: 49R9
R19 = RES.53k6,1%,0.063W,0402: 53.6 kOhms Â±1% 0.063W, 1/16W Chip Resistor 0402 (1005 Metric) Moisture Resistant Thick Film; Manufacturer 1: YAGEO; Manufacturer 1 Part Number: RC0402FR-0753K6L; Vendor 1 Part Number: 311-53.6KLRCT-ND; Vendor 1: DigiKey; Part Name: RES.53k6,1%,0.063W,0402; CreatedBy: Judd Foster; HelpURL: https://www.yageo.com/upload/media/product/products/datasheet/rchip/PYu-RC_Group_51_RoHS_L_12.pdf; Value: 53k6
R20 = RES,88k7,1%,0.063W,0402: 88.7 kOhms Â±1% 0.063W, 1/16W Chip Resistor 0402 (1005 Metric) Automotive AEC-Q200, Moisture Resistant Thick Film; Manufacturer 1: YAGEO; Manufacturer 1 Part Number: AC0402FR-0788K7L; Vendor 1 Part Number: 13-AC0402FR-0788K7LCT-ND; Vendor 1: DigiKey; Part Name: RES,88k7,1%,0.063W,0402; CreatedBy: Judd Foster; HelpURL: https://www.yageo.com/upload/media/product/productsearch/datasheet/rchip/PYu-AC_51_RoHS_L_10.pdf; Value: 88k7
R21 R24 = RES,10k2,1%,0.063W,0402: 10.2 kOhms Â±1% 0.063W, 1/16W Chip Resistor 0402 (1005 Metric) Moisture Resistant Thick Film; Manufacturer 1: YAGEO; Manufacturer 1 Part Number: RC0402FR-0710K2L; Vendor 1 Part Number: YAG2950CT-ND; Vendor 1: DigiKey; Part Name: RES,10k2,1%,0.063W,0402; CreatedBy: Judd Foster; HelpURL: https://www.yageo.com/upload/media/product/products/datasheet/rchip/PYu-RC_Group_51_RoHS_L_12.pdf; Value: 10k2
R22 R23 = RES,10k,5%,0.063W,0402: 10 kOhms ï¿½5% 0.063W, 1/16W Chip Resistor 0402 (1005 Metric) Automotive AEC-Q200 Thick Film; Manufacturer 1: Stackpole Electronics Inc; Manufacturer 1 Part Number: RMCF0402JT10K0; Vendor 1 Part Number: RMCF0402JT10K0CT-ND; Vendor 1: DIgikey; Part Name: RES,10k,5%,0.063W,0402; CreatedBy: Judd Foster; HelpURL: https://www.seielect.com/catalog/sei-rmcf_rmcp.pdf; Value: 10k
R25 = RES,887R,1%,0.063W,0402: 887Î© 62.5mW 50V Â±200ppm/â„ƒ Â±1% Thick Film Resistors 0402 Chip Resistor - Surface Mount ROHS; Manufacturer 1: FH (Guangdong Fenghua Advanced Tech); Manufacturer 1 Part Number: RC-02W8870FT; Vendor 1 Part Number: C321640; Vendor 1: LCSC; Part Name: RES,887R,1%,0.063W,0402; CreatedBy: Judd Foster; HelpURL: https://www.lcsc.com/datasheet/lcsc_datasheet_2411220041_FH--Guangdong-Fenghua-Advanced-Tech-RC-02W8870FT_C321640.pdf
U2 = TPS62932DRLR: Buck Switching Regulator IC Positive Adjustable 0.8V 1 Output 2A SOT-583; Manufacturer 1: Texas Instruments; Vendor 1 Part Number: 296-TPS62932DRLRCT-ND; Vendor 1: DigiKey; Part Name: TPS62932DRLR; CreatedBy: Judd Foster; HelpURL: https://www.ti.com/lit/ds/symlink/tps62932.pdf?ts=1695814293505&ref_url=https%253A%252F%252Fwww.ti.com%252Fsitesearch%252Fen-us%252Fdocs%252Funiversalsearch.tsp%253FlangPref%253Den-US%2526searchTerm%253DTPS62932DRLR%2526nr%253D12%2526login-check%253Dtrue; Manufacturer 1 Part Number: TPS62932DRLR
U3 = LM317G: 75dB@(120Hz) 2.2A Adjustable 1.2V~37V Positive electrode 40V SOT-223 Voltage Regulators - Linear, Low Drop Out (LDO) Regulators ROHS; Manufacturer 1: UMW(Youtai Semiconductor Co., Ltd.); Vendor 1 Part Number: C347367; Vendor 1: LCSC; Part Name: LM317G; CreatedBy: Judd Foster; HelpURL: https://www.lcsc.com/datasheet/lcsc_datasheet_2411131159_UMW-Youtai-Semiconductor-Co---Ltd--LM317G_C347367.pdf; Manufacturer 1 Part Number: LM317G

## Sheet Gate Drive.SchDoc
size 406 x 304 mm; SheetNumber: 6; SheetTotal: 10
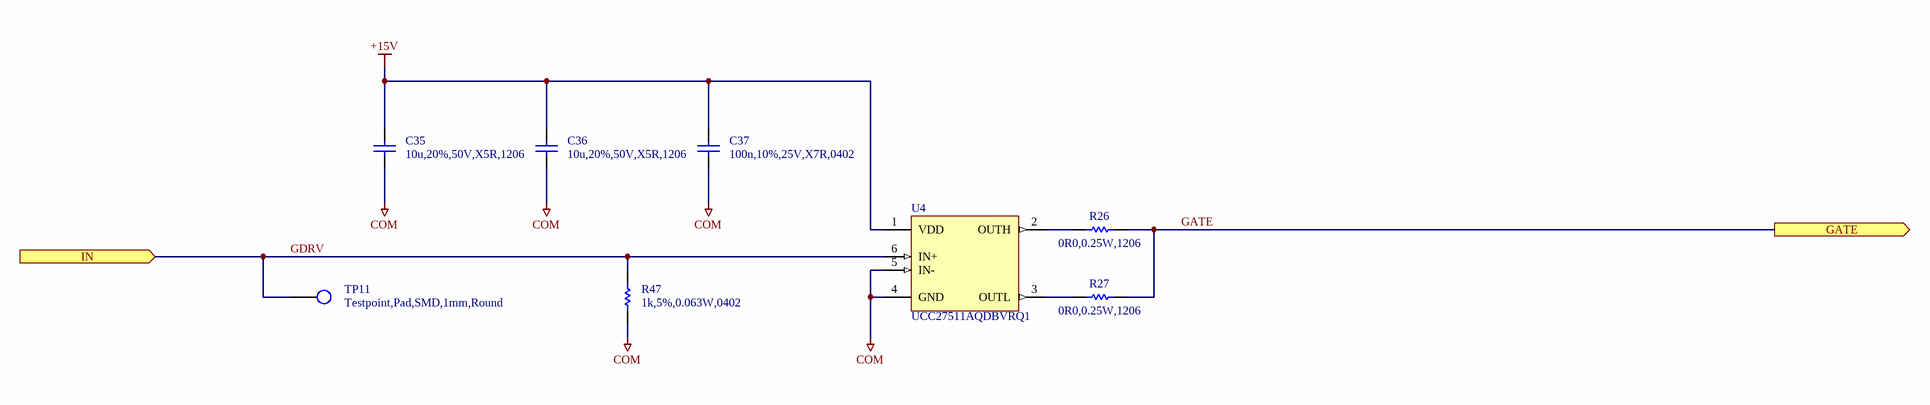
[diagram p5: Gate Drive.SchDoc]

### Parts
C35  10u,20%,50V,X5R,1206  [CAPC3216X16N]
C36  10u,20%,50V,X5R,1206  [CAPC3216X16N]
C37  100n,10%,25V,X7R,0402  [CAPC1005X06N]
R26  0R0,0.25W,1206  [RESC3216X06N]
R27  0R0,0.25W,1206  [RESC3216X06N]
R47  1k,5%,0.063W,0402  [RESC1005X04N]
TP11  Testpoint,Pad,SMD,1mm,Round  [TP100]
U4  UCC27511AQDBVRQ1  [SOTFL95P260X145-6]

### Ports
GATE (out), IN (in)

### Nets
+15V: C35.2 C36.2 C37.2 U4.1(VDD)
COM: C35.1 C36.1 C37.1 R47.1 U4.4(GND) U4.5(IN-)
GATE: R26.2 R27.2 ; port GATE
GDRV: R47.2 TP11.1(TP) U4.6(IN+) ; port IN
NetR26_1: R26.1 U4.2(OUTH)
NetR27_1: R27.1 U4.3(OUTL)

### Notes on the sheet
- Sheet Name:
- Date:
- Sheet
- Designer:
- of

### Library data of the parts
C35 C36 = CAP,Cer,10uF,50VDC,X5R,1206: as C4 on sheet Transformer; Part Name: CAP,Cer,10uF,50VDC,X5R,1206; CreatedBy: Judd Foster; HelpURL: https://www.samsungsem.com/resources/file/global/support/product_catalog/MLCC.pdf; Value: 10u
C37 = CAP,Cer,100nF,10%,25V,X7R,0402: as C19 on sheet Transformer; Part Name: CAP,Cer,100nF,10%,25V,X7R,0402; CreatedBy: Judd Foster; HelpURL: https://search.murata.co.jp/Ceramy/image/img/A01X/G101/ENG/GRM155R71E104KE14-01.pdf
R26 R27 = RES,0R0,0.25W,1206: 0 Ohms Jumper Chip Resistor 1206 (3216 Metric) Automotive AEC-Q200 Thick Film; Manufacturer 1: Stackpole Electronics Inc; Manufacturer 1 Part Number: RMCF1206ZT0R00; Vendor 1 Part Number: RMCF1206ZT0R00CT-ND; Vendor 1: Digikey; Value: 0R; Part Name: RES,0R0,0.25W,1206; CreatedBy: Judd Foster; HelpURL: https://www.seielect.com/catalog/sei-rmcf_rmcp.pdf
R47 = RES,1k,5%,0.063W,0402: 1 kOhms ï¿½5% 0.063W, 1/16W Chip Resistor 0402 (1005 Metric) Automotive AEC-Q200 Thick Film; Manufacturer 1: Stackpole Electronics Inc; Manufacturer 1 Part Number: RMCF0402JT1K00; Vendor 1 Part Number: RMCF0402JT1K00CT-ND; Vendor 1: DIgikey; Part Name: RES,1k,5%,0.063W,0402; CreatedBy: Judd Foster; HelpURL: https://www.seielect.com/catalog/sei-rmcf_rmcp.pdf; Value: 1k
TP11 = Testpoint,Pad,SMD: PCB Testpoint 1mm Round; Part Name: Testpoint,Pad,SMD; CreatedBy: Judd Foster; HelpURL: N/A; Manufacturer 1: N/A; Manufacturer 1 Part Number: N/A; Vendor 1: N/A; Vendor 1 Part Number: N/A
U4 = UCC27511AQDBVRQ1: Gate Drivers Sngl-Ch high-Spd Low-Side Gate Driver; Manufacturer 1: Texas Instruments; Vendor 1 Part Number: 595-UCC27511AQDBVRQ1; Vendor 1: Mouser; Part Name: UCC27511AQDBVRQ1; CreatedBy: Judd Foster; HelpURL: https://www.ti.com/general/docs/suppproductinfo.tsp?distId=26&gotoUrl=https://www.ti.com/lit/gpn/ucc27511a-q1; Manufacturer 1 Part Number: UCC27511AQDBVRQ1

## Sheet Connectors.SchDoc
size 406 x 304 mm; SheetNumber: 8; SheetTotal: 10
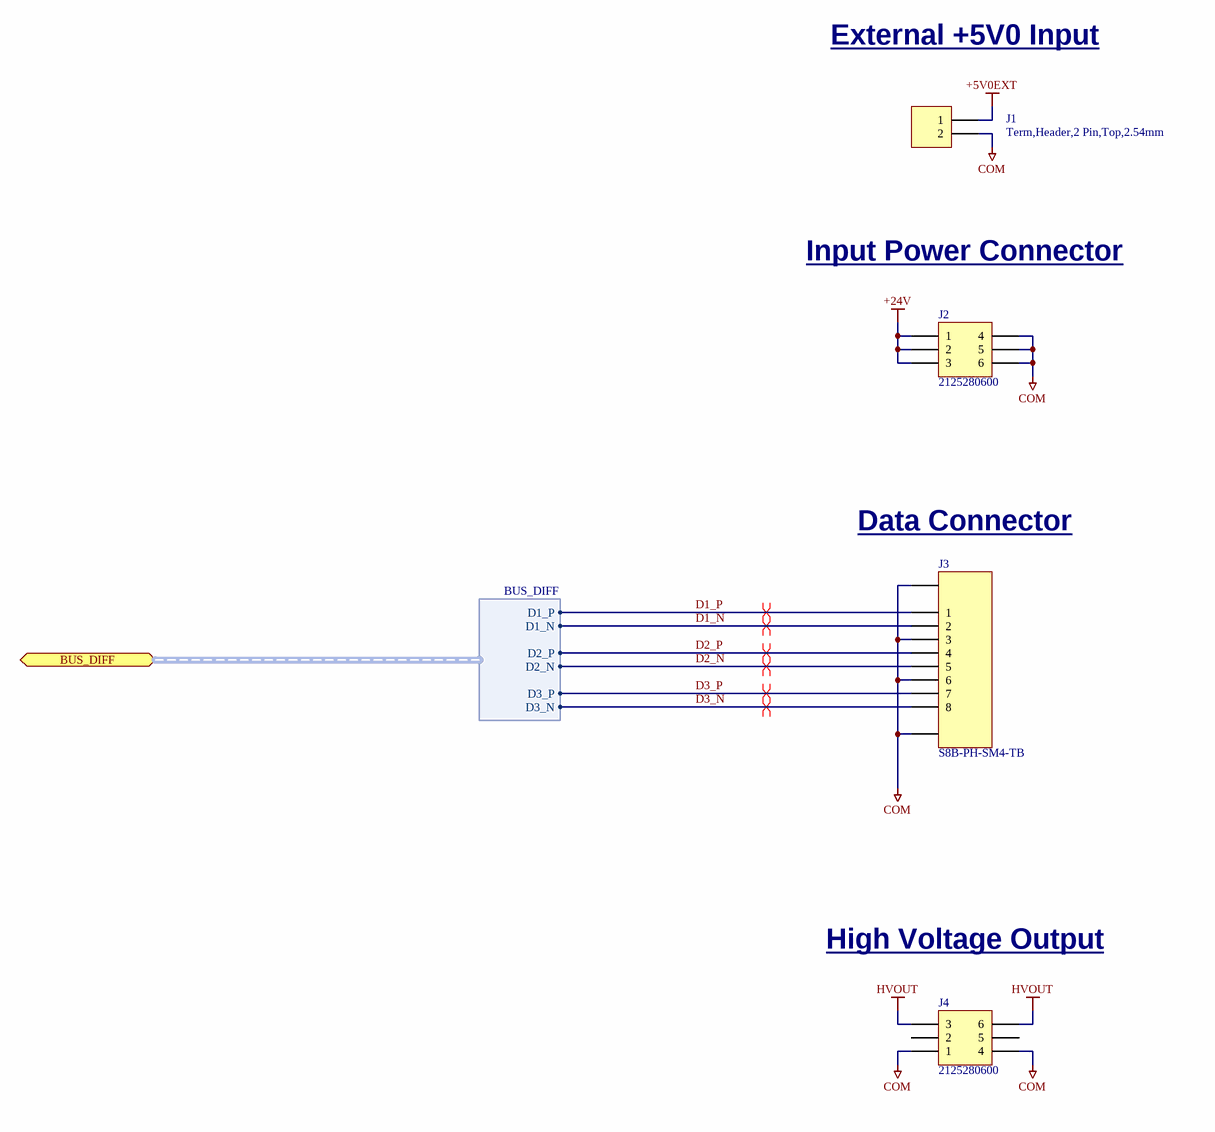
[diagram p6: Connectors.SchDoc]

### Parts
J1  Term,Header,2 Pin,Top,2.54mm  [WURTH_61300211121]
J2  2125280600  [MOLEX_2125280600]
J3  S8B-PH-SM4-TB  [JST_S8B-PH-SM4-TB]
J4  2125280600  [MOLEX_2125280600]

### Ports
BUS_DIFF (bidir, harness BUS_DIFF)

### Harnesses
BUS_DIFF: D1_P, D1_N, D2_P, D2_N, D3_P, D3_N

### Nets
+5V0EXT: J1.1
+24V: J2.1 J2.2 J2.3
COM: J1.2 J2.4 J2.5 J2.6 J3.0 J3.3 J3.6 J4.1 J4.4
HVOUT: J4.3 J4.6
D1_N: J3.2 ; port BUS_DIFF.D1_N
D1_P: J3.1 ; port BUS_DIFF.D1_P
D2_N: J3.5 ; port BUS_DIFF.D2_N
D2_P: J3.4 ; port BUS_DIFF.D2_P
D3_N: J3.8 ; port BUS_DIFF.D3_N
D3_P: J3.7 ; port BUS_DIFF.D3_P

Not connected (* = marked no-connect by the designer): J4 2 5

### Layout directives
differential pair: D1_N, D1_P, D2_N, D2_P, D3_N, D3_P

### Notes on the sheet
- External +5V0 Input
- Input Power Connector
- (near J3) Data Connector
- High Voltage Output
- Sheet Name:
- Date:
- Sheet
- Designer:
- of

### Library data of the parts
J1 = Term,Header,2 Pin,Top,2.54mm: Connector Header Through Hole 2 position 0.100" (2.54mm); Manufacturer 1: WÃ¼rth Elektronik; Manufacturer 1 Part Number: 61300211121; Vendor 1 Part Number: 732-5315-ND; Vendor 1: DigiKey; Part Name: Term,Header,2 Pin,Top,2.54mm; CreatedBy: Judd Foster; HelpURL: https://www.we-online.com/components/products/datasheet/61300211121.pdf
J2 J4 = Conn,Micro-Fit,Hdr,6Pos,RA,Thru: Connector Header Through Hole, Right Angle 6 position 0.118" (3.00mm); Manufacturer 1: Molex; Vendor 1 Part Number: 900-2125280600-ND; Vendor 1: Digikey; Part Name: Conn,Micro-Fit,Hdr,6Pos,RA,Thru; CreatedBy: Judd Foster; HelpURL: https://www.molex.com/webdocs/datasheets/pdf/en-us/2125280600_PCB_HEADERS.pdf; Manufacturer 1 Part Number: 2125280600
J3 = CONN,JST,8 Pin,2mm,RA,SMD: Connector Header Surface Mount, Right Angle 8 position 0.079" (2.00mm); Manufacturer 1: JST Sales America Inc.; Vendor 1 Part Number: 455-S8B-PH-SM4-TBCT-ND; Vendor 1: DigiKey; Part Name: CONN,JST,8 Pin,2mm,RA,SMD; CreatedBy: Judd Foster; HelpURL: https://www.jst-mfg.com/product/pdf/eng/ePH.pdf; Manufacturer 1 Part Number: S8B-PH-SM4-TB

## Sheet Transceivers.SchDoc
size 406 x 304 mm; SheetNumber: 7; SheetTotal: 10
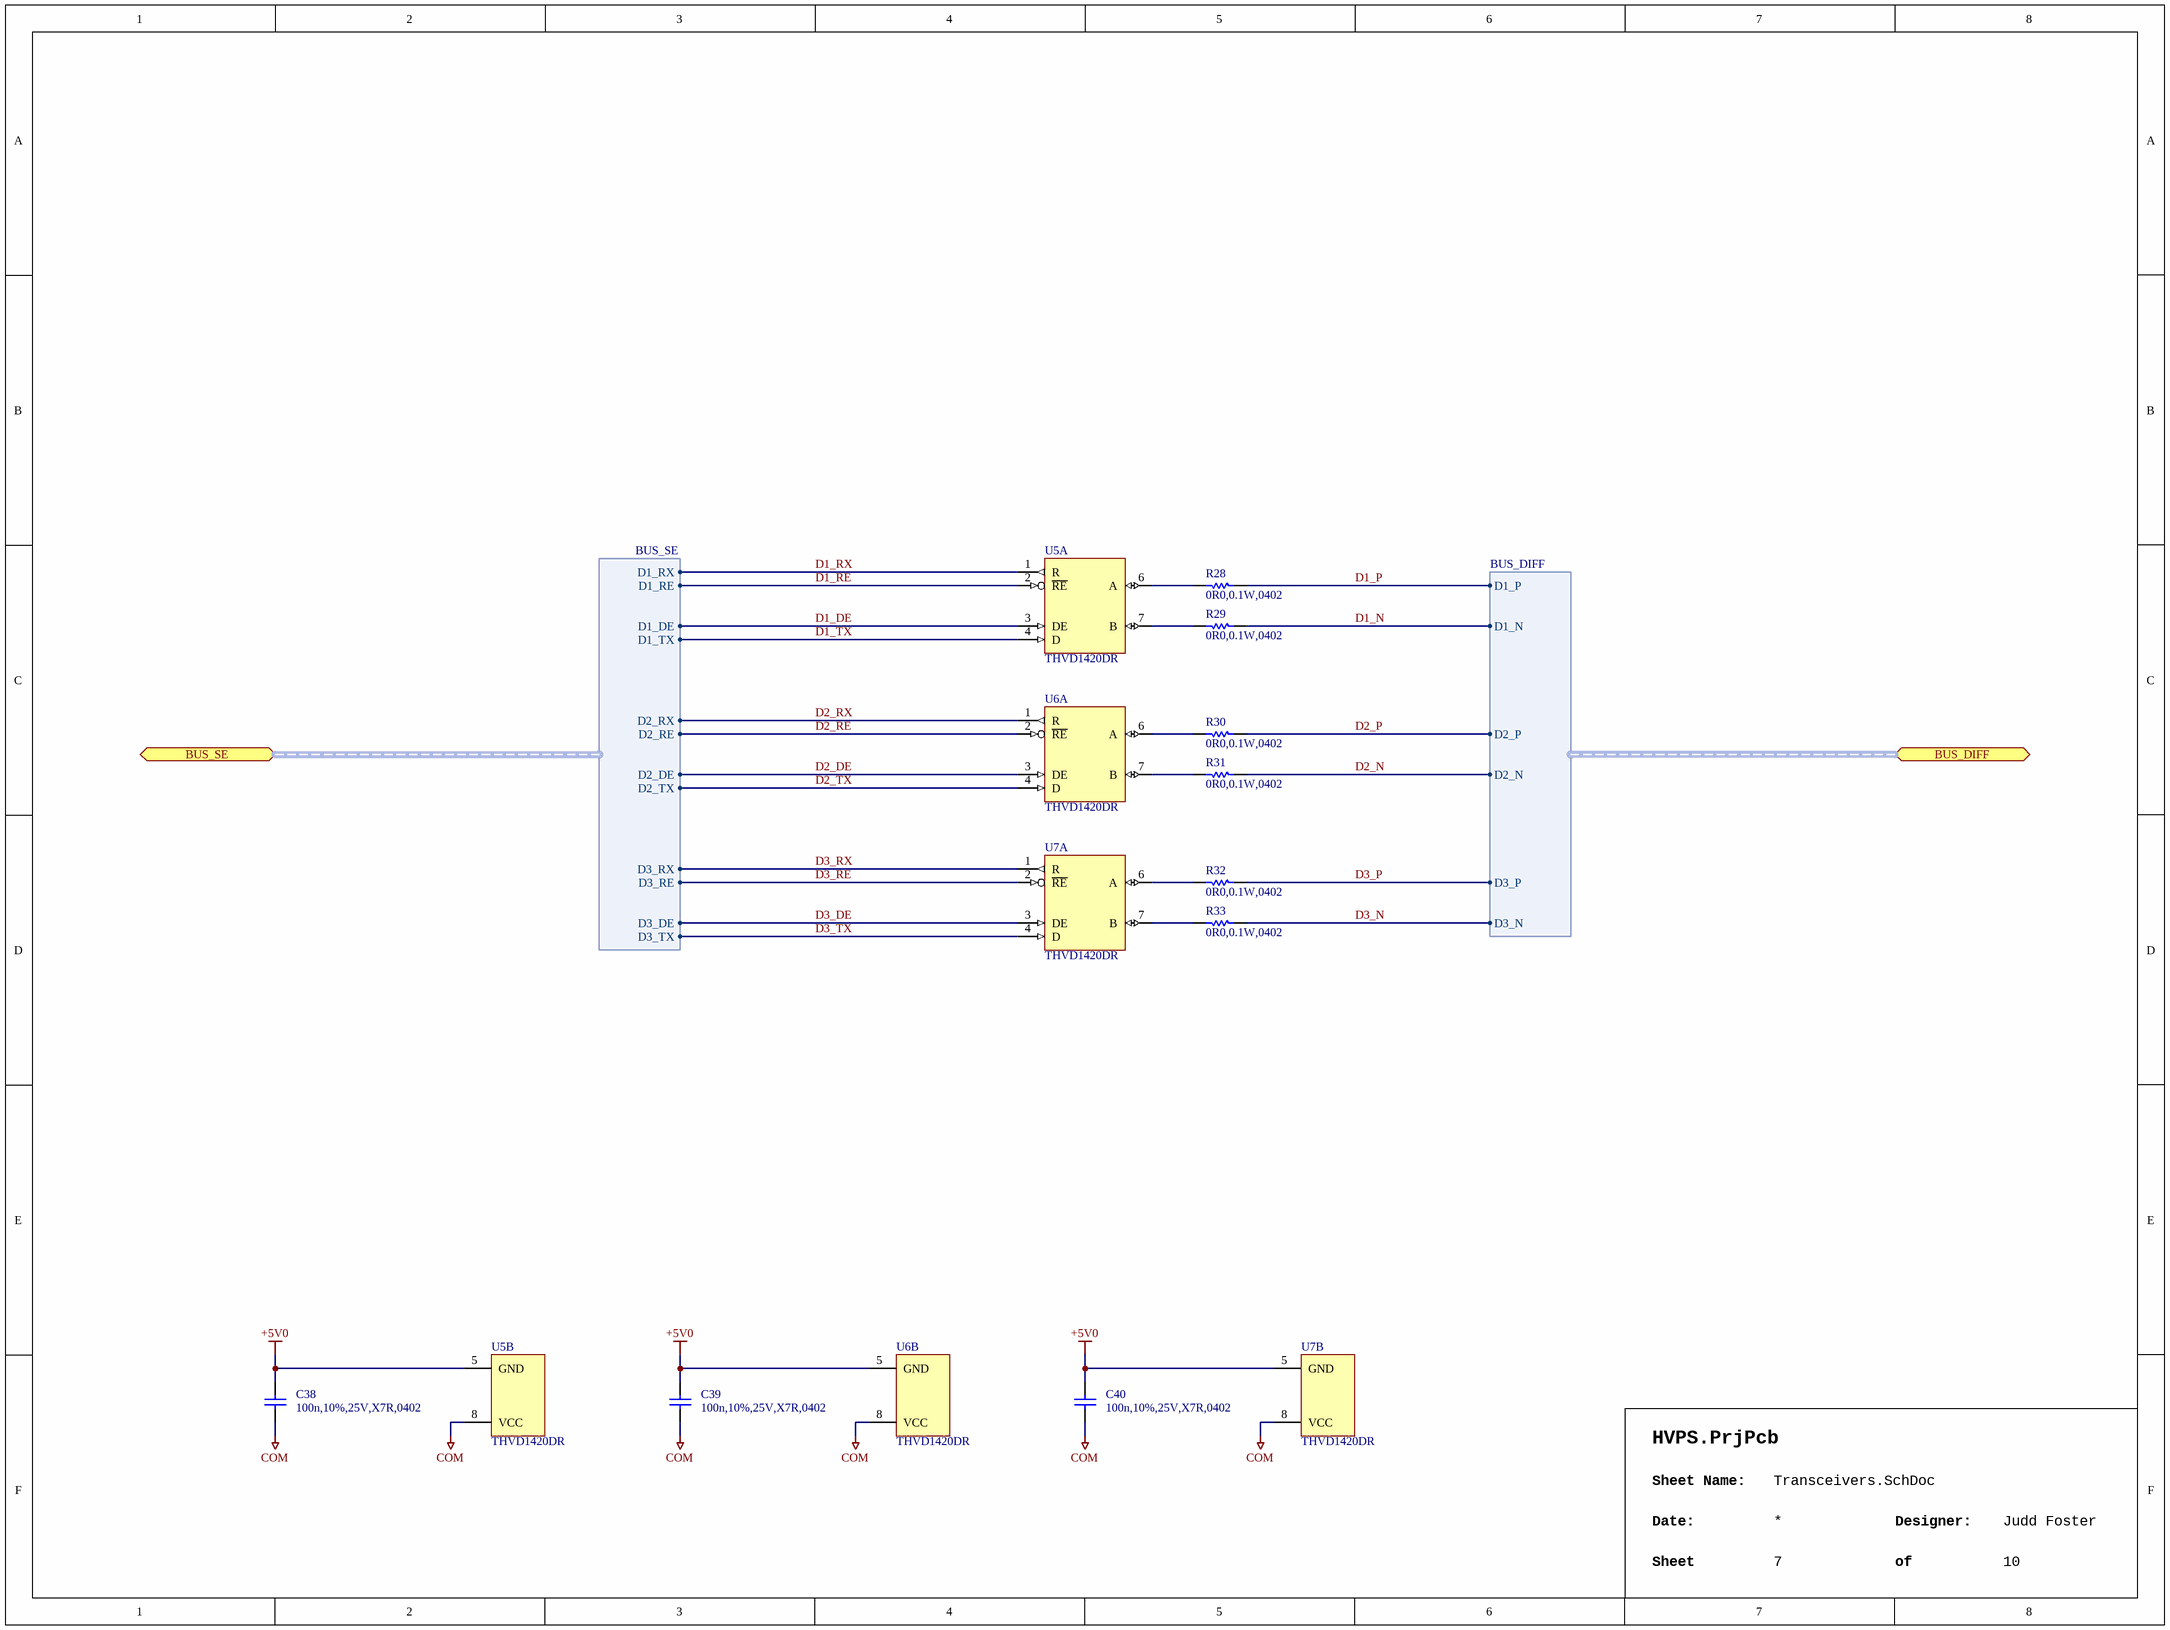
[diagram p7: Transceivers.SchDoc]

### Parts
C38  100n,10%,25V,X7R,0402  [CAPC1005X06N]
C39  100n,10%,25V,X7R,0402  [CAPC1005X06N]
C40  100n,10%,25V,X7R,0402  [CAPC1005X06N]
R28  0R0,0.1W,0402  [RESC1005X04N]
R29  0R0,0.1W,0402  [RESC1005X04N]
R30  0R0,0.1W,0402  [RESC1005X04N]
R31  0R0,0.1W,0402  [RESC1005X04N]
R32  0R0,0.1W,0402  [RESC1005X04N]
R33  0R0,0.1W,0402  [RESC1005X04N]
U5  THVD1420DR  [TEXASINSTRUMENTS_PKG_D0008A]  (parts A,B of 2)
U6  THVD1420DR  [TEXASINSTRUMENTS_PKG_D0008A]  (parts A,B of 2)
U7  THVD1420DR  [TEXASINSTRUMENTS_PKG_D0008A]  (parts A,B of 2)

### Ports
BUS_DIFF (bidir, harness BUS_DIFF), BUS_SE (bidir, harness BUS_SE)

### Harnesses
BUS_DIFF: D1_P, D1_N, D2_P, D2_N, D3_P, D3_N
BUS_SE: D1_RX, D1_DE, D1_RE, D1_TX, D3_RX, D3_DE, D3_RE, D3_TX, D2_RX, D2_DE, D2_RE, D2_TX

### Nets
+5V0: C38.2 C39.2 C40.2 U5.5(GND) U6.5(GND) U7.5(GND)
COM: C38.1 C39.1 C40.1 U5.8(VCC) U6.8(VCC) U7.8(VCC)
D1_DE: U5.3(DE) ; port BUS_SE.D1_DE
D1_N: R29.1 ; port BUS_DIFF.D1_N
D1_P: R28.1 ; port BUS_DIFF.D1_P
D1_RE: U5.2(~{RE}) ; port BUS_SE.D1_RE
D1_RX: U5.1(R) ; port BUS_SE.D1_RX
D1_TX: U5.4(D) ; port BUS_SE.D1_TX
D2_DE: U6.3(DE) ; port BUS_SE.D2_DE
D2_N: R31.1 ; port BUS_DIFF.D2_N
D2_P: R30.1 ; port BUS_DIFF.D2_P
D2_RE: U6.2(~{RE}) ; port BUS_SE.D2_RE
D2_RX: U6.1(R) ; port BUS_SE.D2_RX
D2_TX: U6.4(D) ; port BUS_SE.D2_TX
D3_DE: U7.3(DE) ; port BUS_SE.D3_DE
D3_N: R33.1 ; port BUS_DIFF.D3_N
D3_P: R32.1 ; port BUS_DIFF.D3_P
D3_RE: U7.2(~{RE}) ; port BUS_SE.D3_RE
D3_RX: U7.1(R) ; port BUS_SE.D3_RX
D3_TX: U7.4(D) ; port BUS_SE.D3_TX
NetR28_2: R28.2 U5.6(A)
NetR29_2: R29.2 U5.7(B)
NetR30_2: R30.2 U6.6(A)
NetR31_2: R31.2 U6.7(B)
NetR32_2: R32.2 U7.6(A)
NetR33_2: R33.2 U7.7(B)

### Notes on the sheet
- Sheet Name:
- Date:
- Sheet
- Designer:
- of

### Library data of the parts
C38-C40 = CAP,Cer,100nF,10%,25V,X7R,0402: as C19 on sheet Transformer; Part Name: CAP,Cer,100nF,10%,25V,X7R,0402; CreatedBy: Judd Foster; HelpURL: https://search.murata.co.jp/Ceramy/image/img/A01X/G101/ENG/GRM155R71E104KE14-01.pdf
R28-R33 = RES,0R0,0.1W,0402: 0 Ohms Jumper 0.1W, 1/10W Chip Resistor 0402 (1005 Metric) Automotive AEC-Q200 Thick Film; Manufacturer 1: Panasonic Electronic Components; Manufacturer 1 Part Number: ERJ-2GE0R00X; Vendor 1 Part Number: P0.0JCT-ND; Vendor 1: Digikey; Value: 0R; Part Name: RES,0R0,0.1W,0402; CreatedBy: Judd Foster; HelpURL: https://industrial.panasonic.com/cdbs/www-data/pdf/RDA0000/AOA0000C301.pdf
U5-U7 = THVD1420DR: 1/1 Transceiver Half RS422, RS485 8-SOIC; Manufacturer 1: Texas Instruments; Vendor 1 Part Number: 296-THVD1420DRCT-ND; Vendor 1: DigiKey; Part Name: THVD1420DR; CreatedBy: Judd Foster; HelpURL: https://www.ti.com/lit/ds/symlink/thvd1420.pdf?HQS=dis-dk-null-digikeymode-dsf-pf-null-wwe&ts=1735314435967; Manufacturer 1 Part Number: THVD1420DR

## Sheet Comparators.SchDoc
size 406 x 304 mm; SheetNumber: 10; SheetTotal: 10
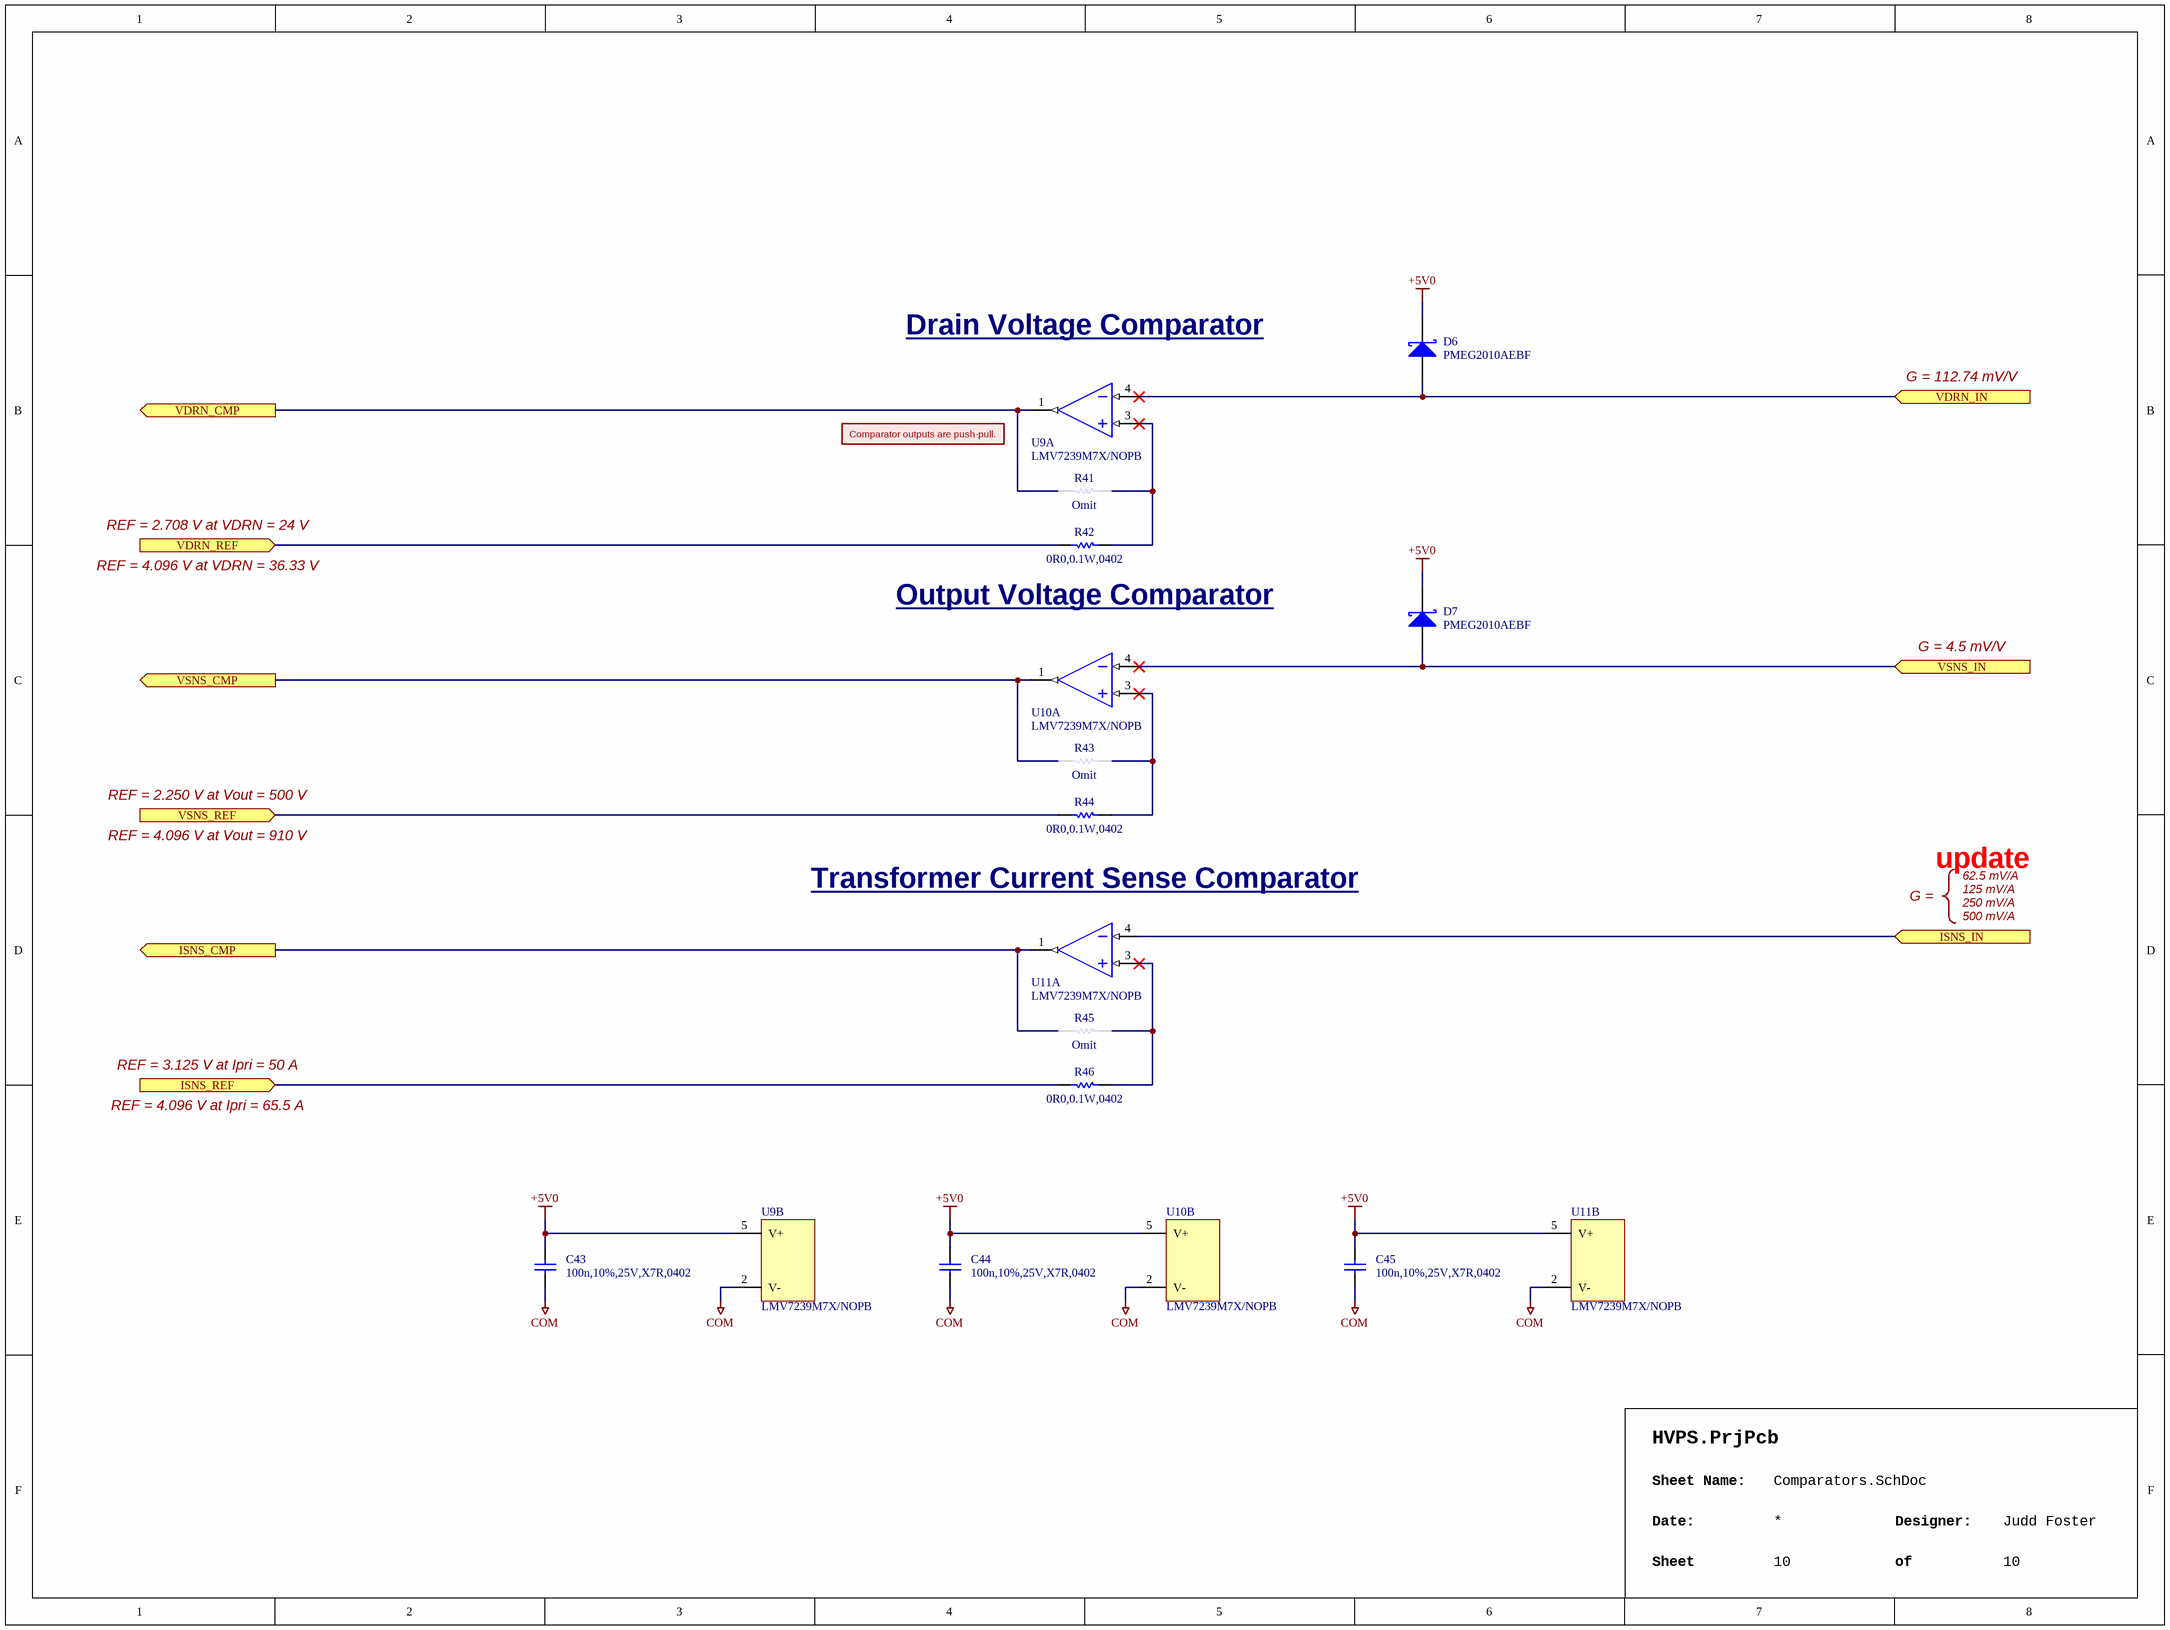
[diagram p8: Comparators.SchDoc]

### Parts
C43  100n,10%,25V,X7R,0402  [CAPC1005X06N]
C44  100n,10%,25V,X7R,0402  [CAPC1005X06N]
C45  100n,10%,25V,X7R,0402  [CAPC1005X06N]
D6  PMEG2010AEBF  [NEXPERIA_PKG_SOD523]
D7  PMEG2010AEBF  [NEXPERIA_PKG_SOD523]
R41  Omit  [RESC1005X04N]  (no BOM)
R42  0R0,0.1W,0402  [RESC1005X04N]
R43  Omit  [RESC1005X04N]  (no BOM)
R44  0R0,0.1W,0402  [RESC1005X04N]
R45  Omit  [RESC1005X04N]  (no BOM)
R46  0R0,0.1W,0402  [RESC1005X04N]
U9  LMV7239M7X/NOPB  [SOTFL65P210X110-6N]  (parts A,B of 2)
U10  LMV7239M7X/NOPB  [SOTFL65P210X110-6N]  (parts A,B of 2)
U11  LMV7239M7X/NOPB  [SOTFL65P210X110-6N]  (parts A,B of 2)

### Ports
ISNS_CMP (out), ISNS_IN (in), ISNS_REF (in), VDRN_CMP (out), VDRN_IN (in), VDRN_REF (in), VSNS_CMP (out), VSNS_IN (in), VSNS_REF (in)

### Nets
+5V0: C43.2 C44.2 C45.2 D6.1(K) D7.1(K) U9.5(V+) U10.5(V+) U11.5(V+)
COM: C43.1 C44.1 C45.1 U9.2(V-) U10.2(V-) U11.2(V-)
DRAIN: D6.2(A) U9.4(IN-) ; port VDRN_IN
ISENSE: U11.4(IN-) ; port ISNS_IN
ISNS_CMP: R45.1 U11.1(VOUT) ; port ISNS_CMP
ISNS_REF: R46.1 ; port ISNS_REF
VDIV: D7.2(A) U10.4(IN-) ; port VSNS_IN
VDRN_CMP: R41.1 U9.1(VOUT) ; port VDRN_CMP
VDRN_REF: R42.1 ; port VDRN_REF
VSNS_CMP: R43.1 U10.1(VOUT) ; port VSNS_CMP
VSNS_REF: R44.1 ; port VSNS_REF
NetR41_2: R41.2 R42.2 U9.3(IN+)
NetR43_2: R43.2 R44.2 U10.3(IN+)
NetR45_2: R45.2 R46.2 U11.3(IN+)

### Notes on the sheet
- www
- Drain Voltage Comparator
- Comparator outputs are push-pull.
- G = 112.74 mV/V
- REF = 2.708 V at VDRN = 24 V
- REF = 4.096 V at VDRN = 36.33 V
- Output Voltage Comparator
- G = 4.5 mV/V
- REF = 2.250 V at Vout = 500 V
- REF = 4.096 V at Vout = 910 V
- Transformer Current Sense Comparator
- G =
- update
- 250 mV/A
- 125 mV/A
- 62.5 mV/A
- 500 mV/A
- REF = 3.125 V at Ipri = 50 A
- REF = 4.096 V at Ipri = 65.5 A
- Sheet Name:
- Date:
- Sheet
- Designer:
- of

### Library data of the parts
C43-C45 = CAP,Cer,100nF,10%,25V,X7R,0402: as C19 on sheet Transformer; Part Name: CAP,Cer,100nF,10%,25V,X7R,0402; CreatedBy: Judd Foster; HelpURL: https://search.murata.co.jp/Ceramy/image/img/A01X/G101/ENG/GRM155R71E104KE14-01.pdf
D6 D7 = DIODE,Schottky,20V,1A,SOD523: Diode 20 V 1A Surface Mount SOD-523; Manufacturer 1: Nexperia USA Inc.; Vendor 1 Part Number: 1727-8539-1-ND; Vendor 1: DigiKey; Part Name: DIODE,Schottky,20V,1A,SOD523; CreatedBy: Judd Foster; HelpURL: https://assets.nexperia.com/documents/data-sheet/PMEG2010AEB.pdf; Manufacturer 1 Part Number: PMEG2010AEBF
R41 R43 R45 = RES,Omit,0402: Part Name: RES,Omit,0402; CreatedBy: Judd Foster; HelpURL: N/A; Manufacturer 1: N/A; Manufacturer 1 Part Number: N/A; Vendor 1: N/A; Vendor 1 Part Number: N/A; Value: Omit
R42 R44 R46 = RES,0R0,0.1W,0402: as R28 on sheet Transceivers; Part Name: RES,0R0,0.1W,0402; CreatedBy: Judd Foster; HelpURL: https://industrial.panasonic.com/cdbs/www-data/pdf/RDA0000/AOA0000C301.pdf
U9-U11 = LMV7239M7X/NOPB: Comparator General Purpose Push-Pull SC-70-5; Manufacturer 1: Texas Instruments; Vendor 1 Part Number: 296-35198-1-ND; Vendor 1: Digikey; Part Name: LMV7239M7X/NOPB; CreatedBy: Judd Foster; HelpURL: https://www.ti.com/general/docs/suppproductinfo.tsp?distId=10&gotoUrl=https%3A%2F%2Fwww.ti.com%2Flit%2Fgpn%2Flmv7235; Manufacturer 1 Part Number: LMV7239M7X/NOPB

## Sheet Microcontroller.SchDoc
size 406 x 304 mm; SheetNumber: 9; SheetTotal: 10
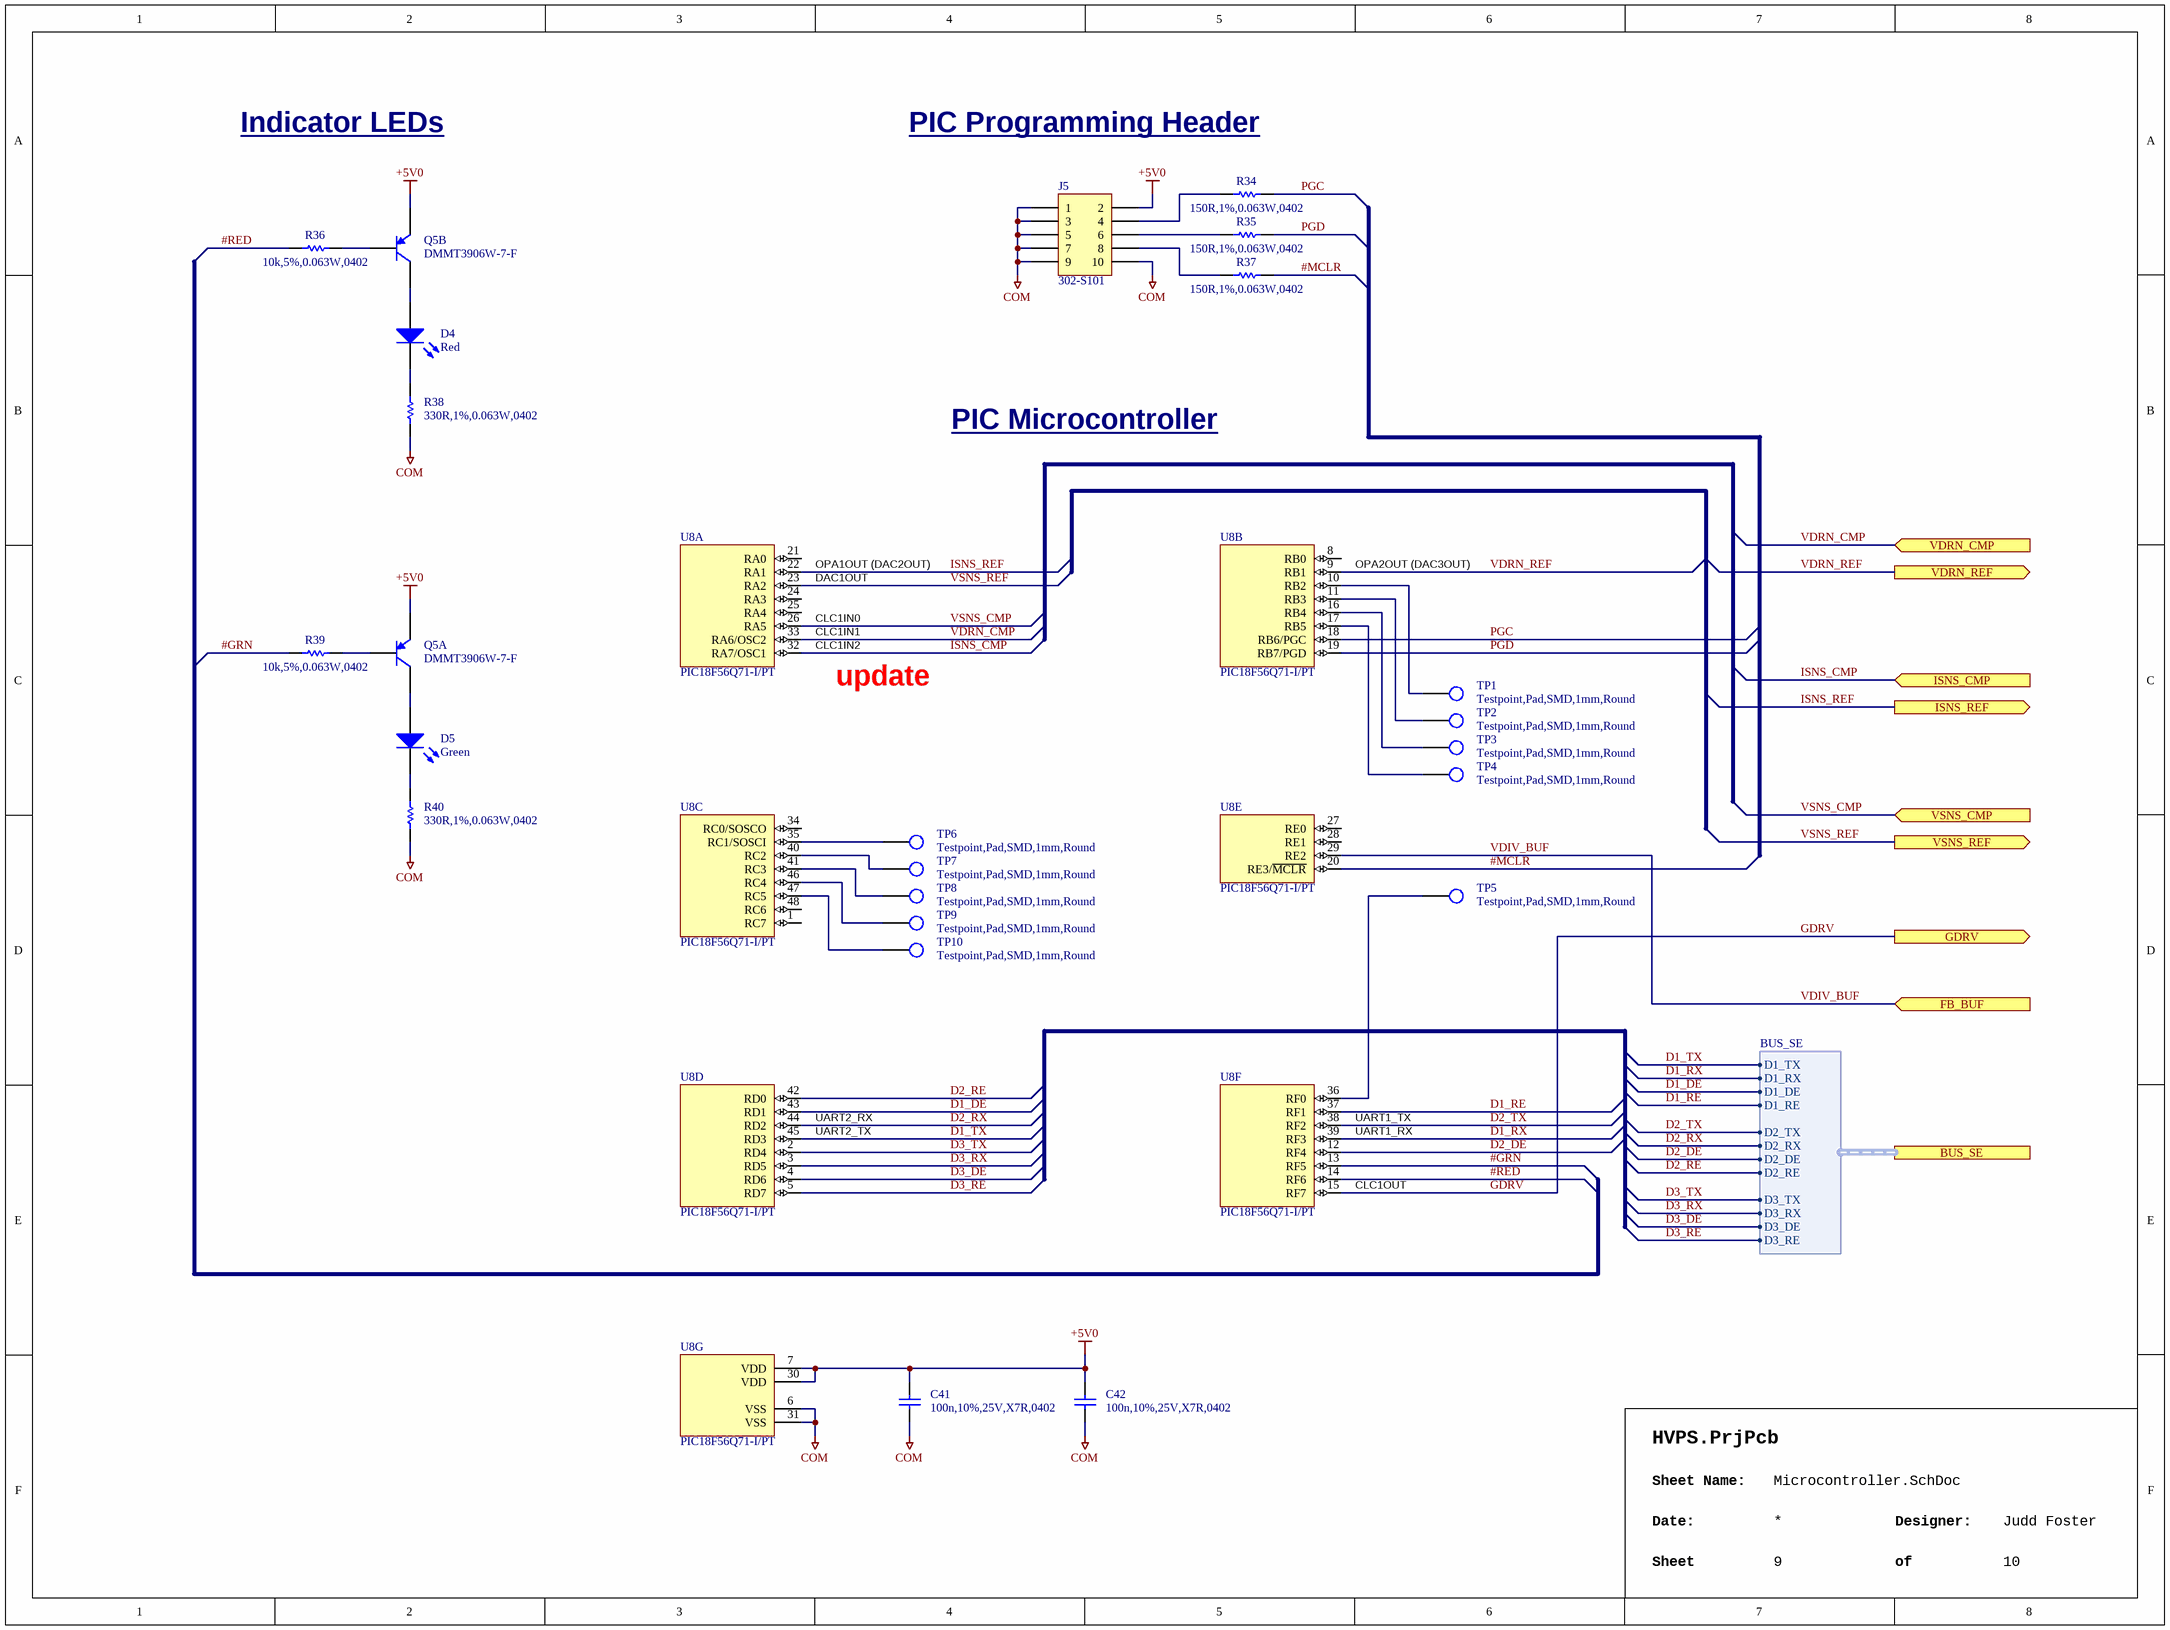
[diagram p9: Microcontroller.SchDoc]

### Parts
C41  100n,10%,25V,X7R,0402  [CAPC1005X06N]
C42  100n,10%,25V,X7R,0402  [CAPC1005X06N]
D4  Red  [LITE-ON_LTST-C190KRKT]
D5  Green  [LITE-ON_LTST-C190KGKT]
J5  302-S101  [ONSHORE_302-S101]
Q5  DMMT3906W-7-F  [DIODES_SOT363]  (parts A,B of 2)
R34  150R,1%,0.063W,0402  [RESC1005X04N]
R35  150R,1%,0.063W,0402  [RESC1005X04N]
R36  10k,5%,0.063W,0402  [RESC1005X04N]
R37  150R,1%,0.063W,0402  [RESC1005X04N]
R38  330R,1%,0.063W,0402  [RESC1005X04N]
R39  10k,5%,0.063W,0402  [RESC1005X04N]
R40  330R,1%,0.063W,0402  [RESC1005X04N]
TP1  Testpoint,Pad,SMD,1mm,Round  [TP100]
TP2  Testpoint,Pad,SMD,1mm,Round  [TP100]
TP3  Testpoint,Pad,SMD,1mm,Round  [TP100]
TP4  Testpoint,Pad,SMD,1mm,Round  [TP100]
TP5  Testpoint,Pad,SMD,1mm,Round  [TP100]
TP6  Testpoint,Pad,SMD,1mm,Round  [TP100]
TP7  Testpoint,Pad,SMD,1mm,Round  [TP100]
TP8  Testpoint,Pad,SMD,1mm,Round  [TP100]
TP9  Testpoint,Pad,SMD,1mm,Round  [TP100]
TP10  Testpoint,Pad,SMD,1mm,Round  [TP100]
U8  PIC18F56Q71-I/PT  [TSQFP50P900X900X120-48N]  (parts A,B,C,D,E,F,G of 7)

### Ports
BUS_SE (harness BUS_SE), FB_BUF (in), GDRV (out), ISNS_CMP (in), ISNS_REF (out), VDRN_CMP (in), VDRN_REF (out), VSNS_CMP (in), VSNS_REF (out)

### Harnesses
BUS_SE: D1_RX, D1_DE, D1_RE, D1_TX, D3_RX, D3_RE, D3_DE, D3_TX, D2_RX, D2_DE, D2_RE, D2_TX

### Nets
+5V0: C41.2 C42.2 J5.2 Q5.4(E1) Q5.5(E2) U8.7(VDD) U8.30(VDD)
COM: C41.1 C42.1 J5.1 J5.3 J5.5 J5.7 J5.9 J5.10 R38.1 R40.1 U8.6(VSS) U8.31(VSS)
#GRN: R39.2 U8.13(RF5)
#MCLR: R37.2 U8.20(RE3/~{MCLR})
#RED: R36.2 U8.14(RF6)
D1_DE: U8.43(RD1) ; port BUS_SE.D1_DE
D1_RE: U8.37(RF1) ; port BUS_SE.D1_RE
D1_RX: U8.39(RF3) ; port BUS_SE.D1_RX
D1_TX: U8.45(RD3) ; port BUS_SE.D1_TX
D2_DE: U8.12(RF4) ; port BUS_SE.D2_DE
D2_RE: U8.42(RD0) ; port BUS_SE.D2_RE
D2_RX: U8.44(RD2) ; port BUS_SE.D2_RX
D2_TX: U8.38(RF2) ; port BUS_SE.D2_TX
D3_DE: U8.4(RD6) ; port BUS_SE.D3_DE
D3_RE: U8.5(RD7) ; port BUS_SE.D3_RE
D3_RX: U8.3(RD5) ; port BUS_SE.D3_RX
D3_TX: U8.2(RD4) ; port BUS_SE.D3_TX
GDRV: U8.15(RF7) ; port GDRV
ISNS_CMP: U8.32(RA7/OSC1) ; port ISNS_CMP
ISNS_REF: U8.22(RA1) ; port ISNS_REF
PGC: R34.2 U8.18(RB6/PGC)
PGD: R35.2 U8.19(RB7/PGD)
VDIV_BUF: U8.29(RE2) ; port FB_BUF
VDRN_CMP: U8.33(RA6/OSC2) ; port VDRN_CMP
VDRN_REF: U8.9(RB1) ; port VDRN_REF
VSNS_CMP: U8.26(RA5) ; port VSNS_CMP
VSNS_REF: U8.23(RA2) ; port VSNS_REF
NetD4_A: D4.A Q5.6(C2)
NetD4_C: D4.C R38.2
NetD5_A: D5.A Q5.3(C1)
NetD5_C: D5.C R40.2
NetJ5_4: J5.4 R34.1
NetJ5_6: J5.6 R35.1
NetJ5_8: J5.8 R37.1
NetQ5_1: Q5.1(B2) R36.1
NetQ5_2: Q5.2(B1) R39.1
NetTP1_1: TP1.1(TP) U8.10(RB2)
NetTP2_1: TP2.1(TP) U8.11(RB3)
NetTP3_1: TP3.1(TP) U8.16(RB4)
NetTP4_1: TP4.1(TP) U8.17(RB5)
NetTP5_1: TP5.1(TP) U8.36(RF0)
NetTP6_1: TP6.1(TP) U8.35(RC1/SOSCI)
NetTP7_1: TP7.1(TP) U8.40(RC2)
NetTP8_1: TP8.1(TP) U8.41(RC3)
NetTP9_1: TP9.1(TP) U8.46(RC4)
NetTP10_1: TP10.1(TP) U8.47(RC5)

Not connected (* = marked no-connect by the designer): U8 1(RC7) 8(RB0) 21(RA0) 24(RA3) 25(RA4) 27(RE0) 28(RE1) 34(RC0/SOSCO) 48(RC6)

### Notes on the sheet
- Indicator LEDs
- PIC Programming Header
- PIC Microcontroller
- (near U8) OPA1OUT (DAC2OUT)
- (near U8) OPA2OUT (DAC3OUT)
- (near U8) DAC1OUT
- (near U8) CLC1IN0
- (near U8) CLC1IN1
- (near U8) CLC1IN2
- update
- (near U8) UART2_TX
- (near U8) UART2_RX
- (near U8) UART1_TX
- (near U8) UART1_RX
- (near U8) CLC1OUT
- Sheet Name:
- Date:
- Sheet
- Designer:
- of

### Library data of the parts
C41 C42 = CAP,Cer,100nF,10%,25V,X7R,0402: as C19 on sheet Transformer; Part Name: CAP,Cer,100nF,10%,25V,X7R,0402; CreatedBy: Judd Foster; HelpURL: https://search.murata.co.jp/Ceramy/image/img/A01X/G101/ENG/GRM155R71E104KE14-01.pdf
D4 = LED,Red,SMD,0603: Red 631nm LED Indication - Discrete 2V 0603 (1608 Metric); Manufacturer 1: Lite-On Inc.; Manufacturer 1 Part Number: LTST-C190KRKT; Vendor 1 Part Number: 160-1436-1-ND; Vendor 1: Digikey; Part Name: LED,Red,SMD,0603; CreatedBy: Judd Foster; HelpURL: https://optoelectronics.liteon.com/upload/download/DS-22-99-0151/LTST-C190KRKT.pdf; Value: Red
D5 = LED,Green,SMD,0603: Green 571nm LED Indication - Discrete 2V 0603 (1608 Metric); Manufacturer 1: Lite-On Inc.; Manufacturer 1 Part Number: LTST-C190KGKT; Vendor 1 Part Number: 160-1435-1-ND; Vendor 1: Digikey; Part Name: LED,Green,SMD,0603; CreatedBy: Judd Foster; HelpURL: https://optoelectronics.liteon.com/upload/download/DS22-2000-074/LTST-C190KGKT.PDF; Value: Green
J5 = Term,Header,5x2 Pin,2.54mm,Thru: Connector Header Through Hole 10 position 0.100" (2.54mm); Manufacturer 1: On Shore Technology Inc.; Vendor 1 Part Number: ED1543-ND; Vendor 1: Digikey; Part Name: Term,Header,5x2 Pin,2.54mm,Thru; CreatedBy: Judd Foster; HelpURL: https://mm.digikey.com/Volume0/opasdata/d220001/medias/docus/6025/302-S.pdf; Manufacturer 1 Part Number: 302-S101
Q5 = Trans,PNP,Dual,40V,200mA,SOT363: Bipolar (BJT) Transistor Array 2 PNP (Dual) Matched Pair 40V 200mA 250MHz 200mW Surface Mount SOT-363; Manufacturer 1: Diodes Incorporated; Vendor 1 Part Number: DMMT3906W-FDICT-ND; Vendor 1: Digikey; Part Name: Trans,PNP,Dual,40V,200mA,SOT363; CreatedBy: Judd Foster; HelpURL: https://www.diodes.com/assets/Datasheets/ds30312.pdf; Manufacturer 1 Part Number: DMMT3906W-7-F
R34 R35 R37 = RES,150R,1%,0.1W,0402: 150 Ohms ï¿½1% 0.063W, 1/16W Chip Resistor 0402 (1005 Metric) Automotive AEC-Q200, Moisture Resistant Thick Film; Manufacturer 1: TE Connectivity Passive Product; Manufacturer 1 Part Number: CRGCQ0402F150R; Vendor 1 Part Number: A129617CT-ND; Vendor 1: Digikey; Part Name: RES,150R,1%,0.1W,0402; CreatedBy: Judd Foster; HelpURL: https://www.te.com/commerce/DocumentDelivery/DDEController?Action=srchrtrv&DocNm=1773204-3&DocType=DS&DocLang=English; Value: 150R
R36 R39 = RES,10k,5%,0.063W,0402: as R22 on sheet Power; Part Name: RES,10k,5%,0.063W,0402; CreatedBy: Judd Foster; HelpURL: https://www.seielect.com/catalog/sei-rmcf_rmcp.pdf; Value: 10k
R38 R40 = RES,330R,1%,0.063W,0402: 330 Ohms Â±1% 0.063W, 1/16W Chip Resistor 0402 (1005 Metric) Moisture Resistant Thick Film; Manufacturer 1: YAGEO; Manufacturer 1 Part Number: RC0402FR-07330RL; Vendor 1 Part Number: 311-330LRCT-ND; Vendor 1: DigiKey; Part Name: RES,330R,1%,0.063W,0402; CreatedBy: Judd Foster; HelpURL: https://www.yageo.com/upload/media/product/products/datasheet/rchip/PYu-RC_Group_51_RoHS_L_12.pdf; Value: 330R
TP1-TP10 = Testpoint,Pad,SMD: PCB Testpoint 1mm Round; Part Name: Testpoint,Pad,SMD; CreatedBy: Judd Foster; HelpURL: N/A; Manufacturer 1: N/A; Manufacturer 1 Part Number: N/A; Vendor 1: N/A; Vendor 1 Part Number: N/A
U8 = PIC18F56Q71-I/PT: PIC PICï¿½ 18F Microcontroller IC 8-Bit 64MHz 64KB (64K x 8) FLASH 48-TQFP (7x7); Manufacturer 1: Microchip Technology; Vendor 1 Part Number: 150-PIC18F56Q71-I/PT-ND; Vendor 1: Digikey; Part Name: PIC18F56Q71-I/PT; CreatedBy: Judd Foster; HelpURL: https://ww1.microchip.com/downloads/aemDocuments/documents/MCU08/ProductDocuments/DataSheets/PIC18F26-46-56Q71-Microcontroller-Data-Sheet-DS40002329.pdf; Manufacturer 1 Part Number: PIC18F56Q71-I/PT

## Nets that join several sheets
+5V0: Transformer (C19.2 U12.8), Current Sense Amplifier (L1.2), Power (6 pins), Transceivers (6 pins), Comparators (8 pins), Microcontroller (7 pins)
+5V0EXT: Power (C18.2 Q3.2 R22.2), Connectors (J1.1)
+15V: Power (5 pins), Gate Drive (C35.2 C36.2 C37.2 U4.1)
+24V: Transformer (9 pins), Power (8 pins), Connectors (J2.1 J2.2 J2.3)
COM: Transformer (20 pins), Current Sense Amplifier (5 pins), Power (20 pins), Gate Drive (6 pins), Connectors (9 pins), Transceivers (6 pins), Comparators (6 pins), Microcontroller (12 pins)
HVOUT: Transformer (8 pins), Connectors (J4.3 J4.6)
D1_DE: Transceivers (U5.3), Microcontroller (U8.43)
D1_N: Connectors (J3.2), Transceivers (R29.1)
D1_P: Connectors (J3.1), Transceivers (R28.1)
D1_RE: Transceivers (U5.2), Microcontroller (U8.37)
D1_RX: Transceivers (U5.1), Microcontroller (U8.39)
D1_TX: Transceivers (U5.4), Microcontroller (U8.45)
D2_DE: Transceivers (U6.3), Microcontroller (U8.12)
D2_N: Connectors (J3.5), Transceivers (R31.1)
D2_P: Connectors (J3.4), Transceivers (R30.1)
D2_RE: Transceivers (U6.2), Microcontroller (U8.42)
D2_RX: Transceivers (U6.1), Microcontroller (U8.44)
D2_TX: Transceivers (U6.4), Microcontroller (U8.38)
D3_DE: Transceivers (U7.3), Microcontroller (U8.4)
D3_N: Connectors (J3.8), Transceivers (R33.1)
D3_P: Connectors (J3.7), Transceivers (R32.1)
D3_RE: Transceivers (U7.2), Microcontroller (U8.5)
D3_RX: Transceivers (U7.1), Microcontroller (U8.3)
D3_TX: Transceivers (U7.4), Microcontroller (U8.2)
DRAIN: Transformer (C20.1 R48.1 R49.1), Comparators (D6.2 U9.4)
GATE: Transformer (R4.1 R6.1), Gate Drive (R26.2 R27.2)
GDRV: Gate Drive (R47.2 TP11.1 U4.6), Microcontroller (U8.15)
ISENSE: Current Sense Amplifier (R15.1 U1.1), Comparators (U11.4)
ISNS_CMP: Comparators (R45.1 U11.1), Microcontroller (U8.32)
ISNS_REF: Comparators (R46.1), Microcontroller (U8.22)
SH1_P: Transformer (Q1.3 R8.2), Current Sense Amplifier (R11.2)
SH2_P: Transformer (Q2.3 R10.2), Current Sense Amplifier (R12.2)
VDIV: Transformer (7 pins), Comparators (D7.2 U10.4)
VDIV_BUF: Transformer (U12.6 U12.7), Microcontroller (U8.29)
VDRN_CMP: Comparators (R41.1 U9.1), Microcontroller (U8.33)
VDRN_REF: Comparators (R42.1), Microcontroller (U8.9)
VSNS_CMP: Comparators (R43.1 U10.1), Microcontroller (U8.26)
VSNS_REF: Comparators (R44.1), Microcontroller (U8.23)